# Altium project Carrier_Board_rev2.PrjPcb
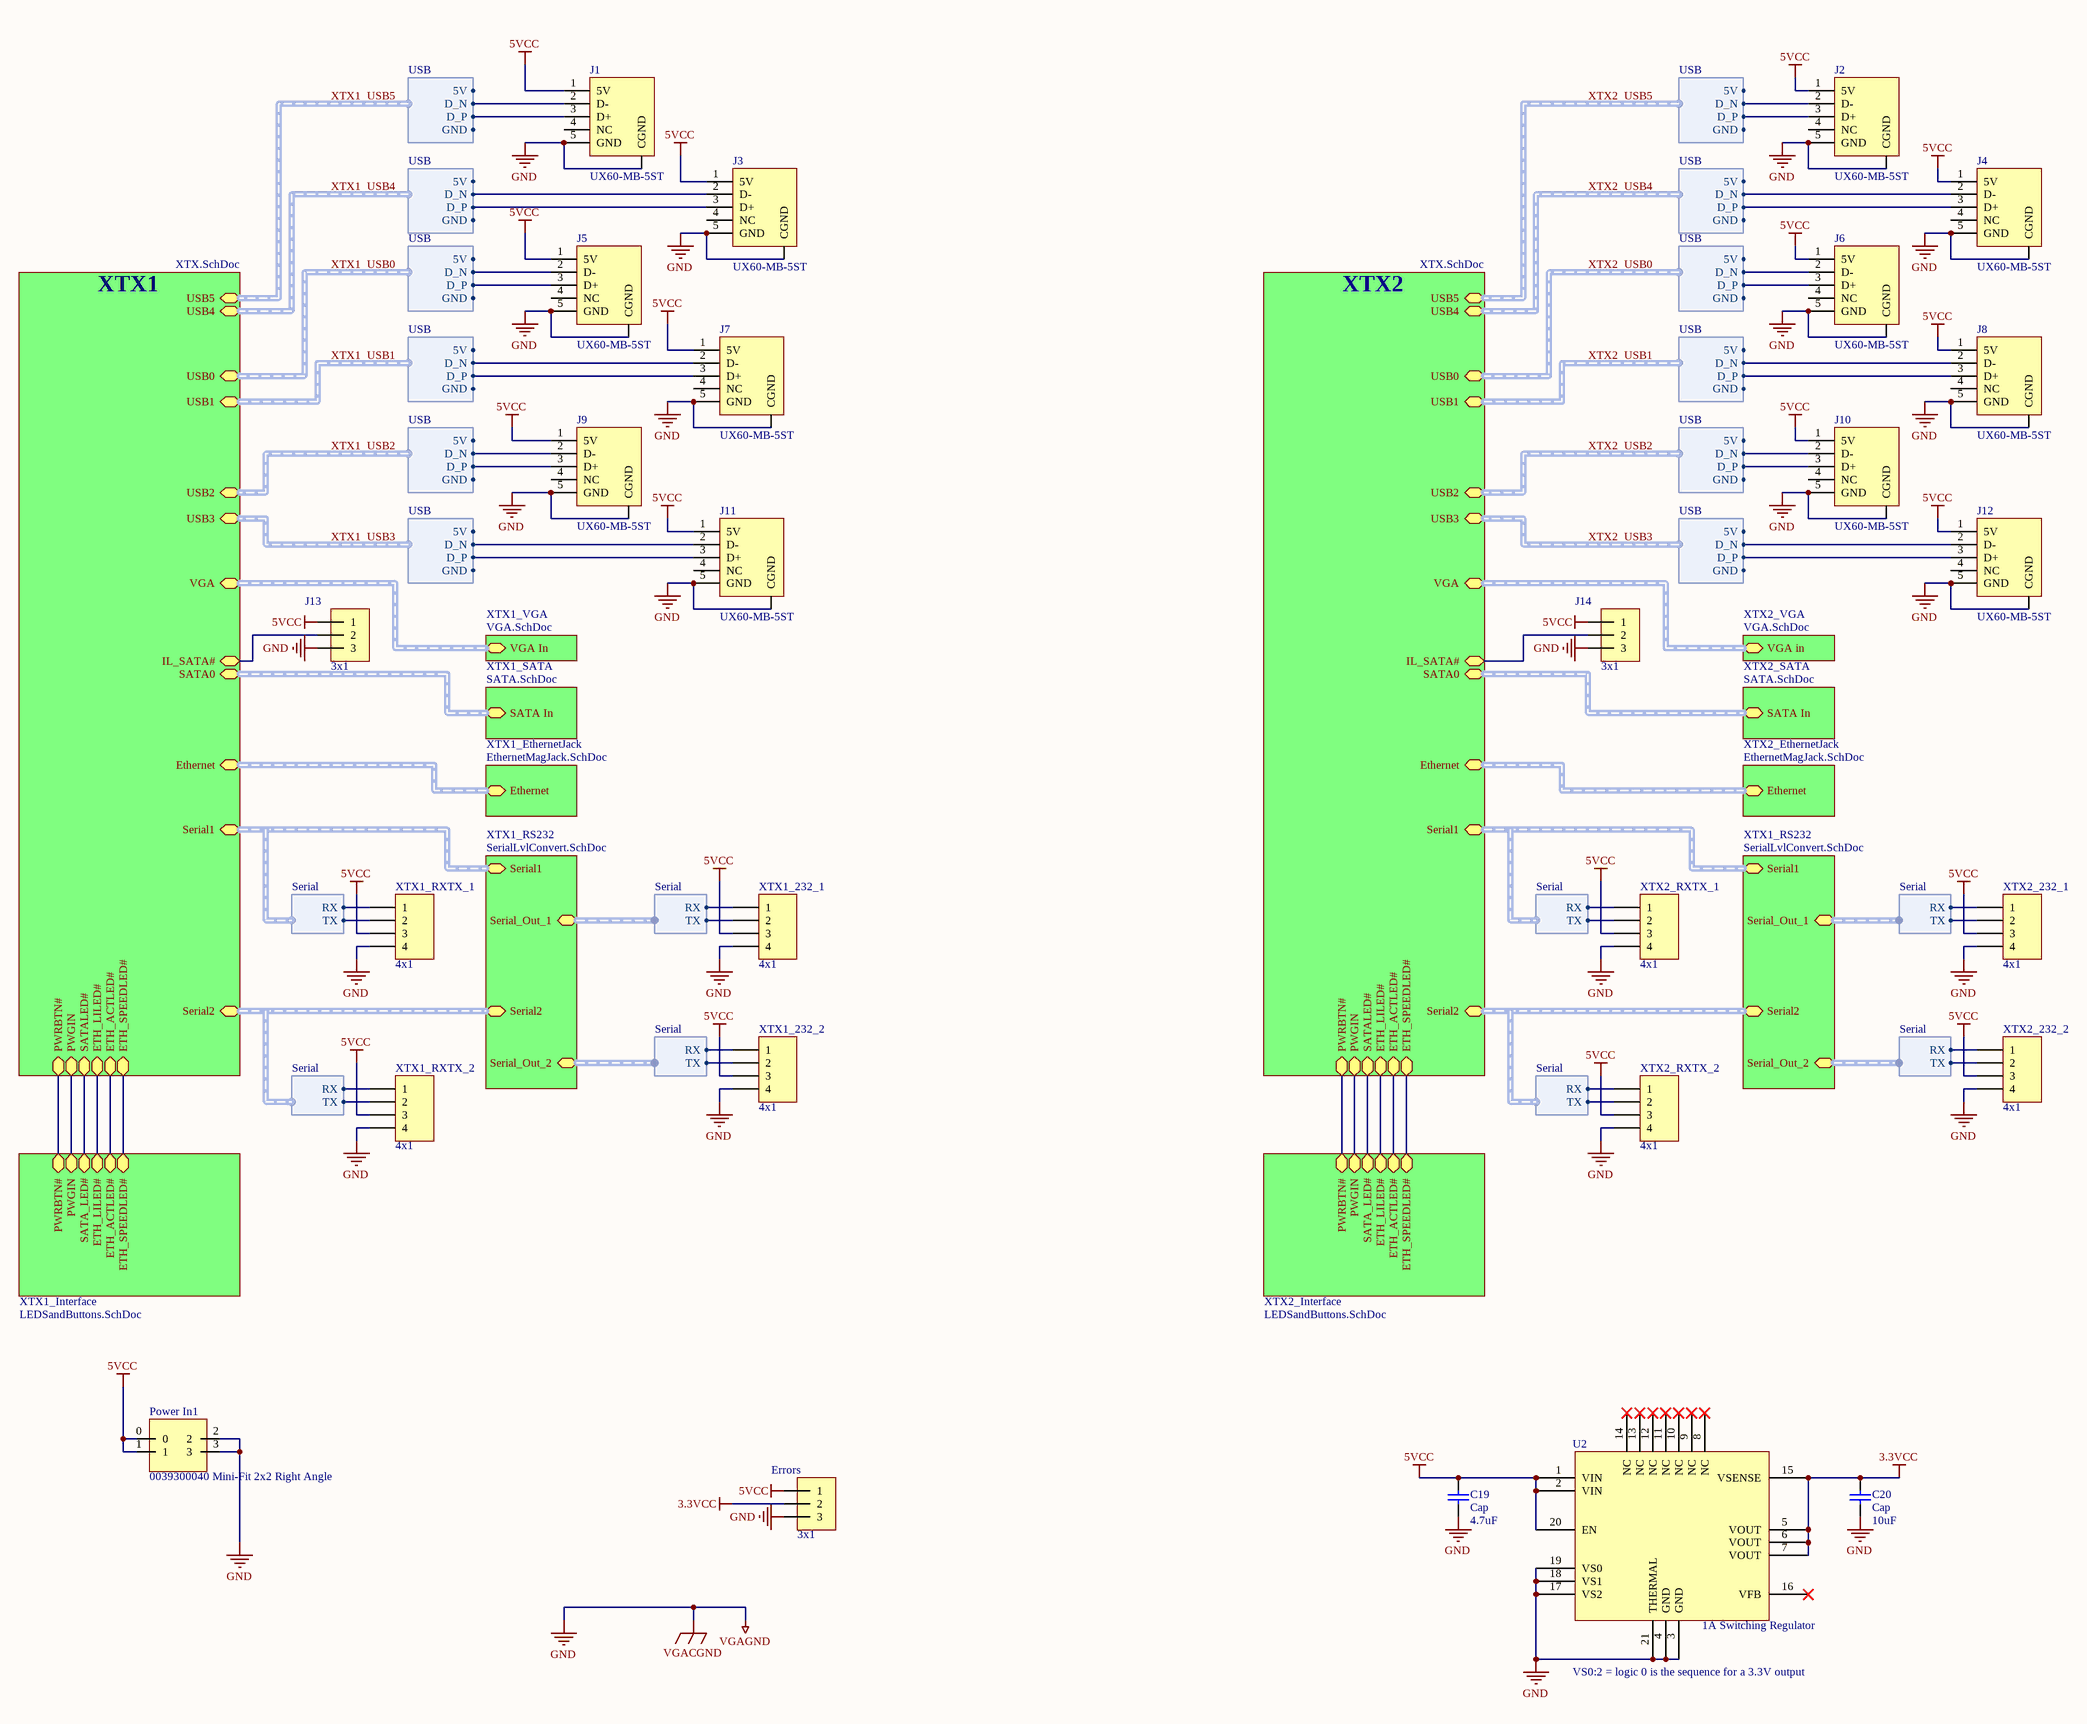
[diagram p0: XTXBoard(2CPU).SchDoc]
7 sheets, 137 parts. Net scope: hierarchical (ports join the sheet entries above them; power ports are global).
Board file: MainBoard.PcbDoc.PcbDoc
Sheets:
  XTXBoard(2CPU).SchDoc
    XTX1 = XTX.SchDoc
    XTX1_VGA = VGA.SchDoc
    XTX1_SATA = SATA.SchDoc
    XTX1_Interface = LEDSandButtons.SchDoc
    XTX1_EthernetJack = EthernetMagJack.SchDoc
    XTX2 = XTX.SchDoc
    XTX2_Interface = LEDSandButtons.SchDoc
    XTX2_VGA = VGA.SchDoc
    XTX2_SATA = SATA.SchDoc
    XTX2_EthernetJack = EthernetMagJack.SchDoc
    XTX1_RS232 = SerialLvlConvert.SchDoc
    XTX1_RS232 = SerialLvlConvert.SchDoc

## Sheet XTXBoard(2CPU).SchDoc
size C; DocumentNumber: 6; SheetNumber: 6; SheetTotal: 8

### Parts
C19  Cap  value 4.7uF  [0805 (2012) Capacitor]
C20  Cap  value 10uF  [1210 (3225) Capacitor]
Errors  3x1  [Male 3x1]
J1  UX60-MB-5ST  [UX60-MB-5ST]
J2  UX60-MB-5ST  [UX60-MB-5ST]
J3  UX60-MB-5ST  [UX60-MB-5ST]
J4  UX60-MB-5ST  [UX60-MB-5ST]
J5  UX60-MB-5ST  [UX60-MB-5ST]
J6  UX60-MB-5ST  [UX60-MB-5ST]
J7  UX60-MB-5ST  [UX60-MB-5ST]
J8  UX60-MB-5ST  [UX60-MB-5ST]
J9  UX60-MB-5ST  [UX60-MB-5ST]
J10  UX60-MB-5ST  [UX60-MB-5ST]
J11  UX60-MB-5ST  [UX60-MB-5ST]
J12  UX60-MB-5ST  [UX60-MB-5ST]
J13  3x1  [Male 3x1]
J14  3x1  [Male 3x1]
Power_In1  0039300040 Mini-Fit 2x2 Right Angle  [0039300040 MINI-FIT JR 4-Pos Right Angle]
U2  1A Switching Regulator  [QFN65P400X500X80-20N]
XTX1_232_1  4x1  [Male 4x1]
XTX1_232_2  4x1  [Male 4x1]
XTX1_RXTX_1  4x1  [Male 4x1]
XTX1_RXTX_2  4x1  [Male 4x1]
XTX2_232_1  4x1  [Male 4x1]
XTX2_232_2  4x1  [Male 4x1]
XTX2_RXTX_1  4x1  [Male 4x1]
XTX2_RXTX_2  4x1  [Male 4x1]

### Sub-sheets
XTX1 = XTX.SchDoc: ETH_LILED#, ETH_ACTLED#, ETH_SPEEDLED#, Ethernet (harness Ethernet), SATA0 (harness SATA), VGA (harness VGA), USB0 (harness USB), USB2 (harness USB), USB3 (harness USB), USB1 (harness USB), SATALED#, Serial1 (harness Serial), Serial2 (harness Serial), PWRBTN#, PWGIN, IL_SATA#, USB5 (harness USB), USB4 (harness USB)
XTX1_EthernetJack = EthernetMagJack.SchDoc: Ethernet (harness Ethernet)
XTX1_Interface = LEDSandButtons.SchDoc: ETH_LILED#, ETH_ACTLED#, SATA_LED#, PWRBTN#, ETH_SPEEDLED#, PWGIN
XTX1_RS232 = SerialLvlConvert.SchDoc: Serial1 (harness Serial), Serial2 (harness Serial), Serial_Out_1 (harness Serial), Serial_Out_2 (harness Serial)
XTX1_RS232 = SerialLvlConvert.SchDoc: Serial1 (harness Serial), Serial2 (harness Serial), Serial_Out_1 (harness Serial), Serial_Out_2 (harness Serial)
XTX1_SATA = SATA.SchDoc: SATA In (harness SATA)
XTX1_VGA = VGA.SchDoc: VGA In (harness VGA)
XTX2 = XTX.SchDoc: USB5 (harness USB), USB4 (harness USB), USB0 (harness USB), USB1 (harness USB), USB2 (harness USB), USB3 (harness USB), VGA (harness VGA), IL_SATA#, SATA0 (harness SATA), Ethernet (harness Ethernet), Serial1 (harness Serial), Serial2 (harness Serial), PWRBTN#, PWGIN, ETH_LILED#, SATALED#, ETH_ACTLED#, ETH_SPEEDLED#
XTX2_EthernetJack = EthernetMagJack.SchDoc: Ethernet (harness Ethernet)
XTX2_Interface = LEDSandButtons.SchDoc: PWRBTN#, PWGIN, SATA_LED#, ETH_LILED#, ETH_ACTLED#, ETH_SPEEDLED#
XTX2_SATA = SATA.SchDoc: SATA In (harness SATA)
XTX2_VGA = VGA.SchDoc: VGA in (harness VGA)

### Harnesses
USB: 5V, D_N, D_P, GND
Serial: RX, TX

### Nets
3.3VCC: C20.2 Errors.2 U2.5(VOUT) U2.6(VOUT) U2.7(VOUT) U2.15(VSENSE)
5VCC: C19.2 Errors.1 J1.1(5V) J2.1(5V) J3.1(5V) J4.1(5V) J5.1(5V) J6.1(5V) J7.1(5V) J8.1(5V) J9.1(5V) J10.1(5V) J11.1(5V) J12.1(5V) J13.1 J14.1 Power_In1.0 Power_In1.1 U2.1(VIN) U2.2(VIN) U2.20(EN) XTX1_232_1.3 XTX1_232_2.3 XTX1_RXTX_1.3 XTX1_RXTX_2.3 XTX2_232_1.3 XTX2_232_2.3 XTX2_RXTX_1.3 XTX2_RXTX_2.3
GND: C19.1 C20.1 Errors.3 J1.5(GND) J1.CGND J2.5(GND) J2.CGND J3.5(GND) J3.CGND J4.5(GND) J4.CGND J5.5(GND) J5.CGND J6.5(GND) J6.CGND J7.5(GND) J7.CGND J8.5(GND) J8.CGND J9.5(GND) J9.CGND J10.5(GND) J10.CGND J11.5(GND) J11.CGND J12.5(GND) J12.CGND J13.3 J14.3 Power_In1.2 Power_In1.3 U2.3(GND) U2.4(GND) U2.17(VS2) U2.18(VS1) U2.19(VS0) U2.21(THERMAL) XTX1_232_1.4 XTX1_232_2.4 XTX1_RXTX_1.4 XTX1_RXTX_2.4 XTX2_232_1.4 XTX2_232_2.4 XTX2_RXTX_1.4 XTX2_RXTX_2.4  [also labelled VGACGND, VGAGND]
ETH_ACTLED#: sheet XTX1/ETH_ACTLED#, sheet XTX1_Interface/ETH_ACTLED#
ETH_ACTLED#: sheet XTX2/ETH_ACTLED#, sheet XTX2_Interface/ETH_ACTLED#  [a separate net that carries the same name]
ETH_LILED#: sheet XTX1/ETH_LILED#, sheet XTX1_Interface/ETH_LILED#
ETH_LILED#: sheet XTX2/ETH_LILED#, sheet XTX2_Interface/ETH_LILED#  [a separate net that carries the same name]
ETH_SPEEDLED#: sheet XTX1/ETH_SPEEDLED#, sheet XTX1_Interface/ETH_SPEEDLED#
ETH_SPEEDLED#: sheet XTX2/ETH_SPEEDLED#, sheet XTX2_Interface/ETH_SPEEDLED#  [a separate net that carries the same name]
IL_SATA#: J13.2 ; sheet XTX1/IL_SATA#
IL_SATA#: J14.2 ; sheet XTX2/IL_SATA#  [a separate net that carries the same name]
IN_RX1: XTX1_RXTX_1.1 ; sheet XTX1/Serial1.RX
IN_RX1: XTX2_RXTX_1.1 ; sheet XTX2/Serial1.RX  [a separate net that carries the same name]
IN_RX2: XTX1_RXTX_2.1 ; sheet XTX1/Serial2.RX
IN_RX2: XTX2_RXTX_2.1 ; sheet XTX2/Serial2.RX  [a separate net that carries the same name]
IN_TX1: XTX1_RXTX_1.2 ; sheet XTX1/Serial1.TX
IN_TX1: XTX2_RXTX_1.2 ; sheet XTX2/Serial1.TX  [a separate net that carries the same name]
IN_TX2: XTX1_RXTX_2.2 ; sheet XTX1/Serial2.TX
IN_TX2: XTX2_RXTX_2.2 ; sheet XTX2/Serial2.TX  [a separate net that carries the same name]
OUT_RX1: XTX1_232_1.1 ; sheet XTX1_RS232/Serial_Out_1.RX
OUT_RX1: XTX2_232_1.1 ; sheet XTX1_RS232/Serial_Out_1.RX  [a separate net that carries the same name]
OUT_RX2: XTX1_232_2.1 ; sheet XTX1_RS232/Serial_Out_2.RX
OUT_RX2: XTX2_232_2.1 ; sheet XTX1_RS232/Serial_Out_2.RX  [a separate net that carries the same name]
OUT_TX1: XTX1_232_1.2 ; sheet XTX1_RS232/Serial_Out_1.TX
OUT_TX1: XTX2_232_1.2 ; sheet XTX1_RS232/Serial_Out_1.TX  [a separate net that carries the same name]
OUT_TX2: XTX1_232_2.2 ; sheet XTX1_RS232/Serial_Out_2.TX
OUT_TX2: XTX2_232_2.2 ; sheet XTX1_RS232/Serial_Out_2.TX  [a separate net that carries the same name]
SATALED#: sheet XTX1/SATALED#, sheet XTX1_Interface/SATA_LED#
SATALED#: sheet XTX2/SATALED#, sheet XTX2_Interface/SATA_LED#  [a separate net that carries the same name]
USB0_N: J5.2(D-) ; sheet XTX1/USB0.D_N
USB0_N: J6.2(D-) ; sheet XTX2/USB0.D_N  [a separate net that carries the same name]
USB0_P: J5.3(D+) ; sheet XTX1/USB0.D_P
USB0_P: J6.3(D+) ; sheet XTX2/USB0.D_P  [a separate net that carries the same name]
USB1_N: J7.2(D-) ; sheet XTX1/USB1.D_N
USB1_N: J8.2(D-) ; sheet XTX2/USB1.D_N  [a separate net that carries the same name]
USB1_P: J7.3(D+) ; sheet XTX1/USB1.D_P
USB1_P: J8.3(D+) ; sheet XTX2/USB1.D_P  [a separate net that carries the same name]
USB2_N: J9.2(D-) ; sheet XTX1/USB2.D_N
USB2_N: J10.2(D-) ; sheet XTX2/USB2.D_N  [a separate net that carries the same name]
USB2_P: J9.3(D+) ; sheet XTX1/USB2.D_P
USB2_P: J10.3(D+) ; sheet XTX2/USB2.D_P  [a separate net that carries the same name]
USB3_N: J11.2(D-) ; sheet XTX1/USB3.D_N
USB3_N: J12.2(D-) ; sheet XTX2/USB3.D_N  [a separate net that carries the same name]
USB3_P: J11.3(D+) ; sheet XTX1/USB3.D_P
USB3_P: J12.3(D+) ; sheet XTX2/USB3.D_P  [a separate net that carries the same name]
USB4_N: J3.2(D-) ; sheet XTX1/USB4.D_N
USB4_N: J4.2(D-) ; sheet XTX2/USB4.D_N  [a separate net that carries the same name]
USB4_P: J3.3(D+) ; sheet XTX1/USB4.D_P
USB4_P: J4.3(D+) ; sheet XTX2/USB4.D_P  [a separate net that carries the same name]
USB5_N: J1.2(D-) ; sheet XTX1/USB5.D_N
USB5_N: J2.2(D-) ; sheet XTX2/USB5.D_N  [a separate net that carries the same name]
USB5_P: J1.3(D+) ; sheet XTX1/USB5.D_P
USB5_P: J2.3(D+) ; sheet XTX2/USB5.D_P  [a separate net that carries the same name]
NetXTX1_Interface_D5_2: sheet XTX1/PWRBTN#, sheet XTX1_Interface/PWRBTN#
NetXTX1_Interface_PWGIN_Switch_1: sheet XTX1/PWGIN, sheet XTX1_Interface/PWGIN
NetXTX2_Interface_D5_2: sheet XTX2/PWRBTN#, sheet XTX2_Interface/PWRBTN#
NetXTX2_Interface_PWGIN_Switch_1: sheet XTX2/PWGIN, sheet XTX2_Interface/PWGIN

Not connected (* = marked no-connect by the designer): J1 4(NC); J2 4(NC); J3 4(NC); J4 4(NC); J5 4(NC); J6 4(NC); J7 4(NC); J8 4(NC); J9 4(NC); J10 4(NC); J11 4(NC); J12 4(NC); U2 8(NC)* 9(NC)* 10(NC)* 11(NC)* 12(NC)* 13(NC)* 14(NC)* 16(VFB)*

### Buses and harness runs
harness sheet XTX1/Ethernet = sheet XTX1_EthernetJack/Ethernet
harness sheet XTX1/SATA0 = sheet XTX1_SATA/SATA In
harness sheet XTX1/Serial1 = sheet XTX1_RS232/Serial1
harness sheet XTX1/Serial2 = sheet XTX1_RS232/Serial2
harness sheet XTX1/VGA = sheet XTX1_VGA/VGA In
harness sheet XTX1_RS232/Serial1 = sheet XTX2/Serial1
harness sheet XTX1_RS232/Serial2 = sheet XTX2/Serial2
harness sheet XTX2/Ethernet = sheet XTX2_EthernetJack/Ethernet
harness sheet XTX2/SATA0 = sheet XTX2_SATA/SATA In
harness sheet XTX2/VGA = sheet XTX2_VGA/VGA in
harness XTX1_USB0 = sheet XTX1/USB0
harness XTX1_USB1 = sheet XTX1/USB1
harness XTX1_USB2 = sheet XTX1/USB2
harness XTX1_USB3 = sheet XTX1/USB3
harness XTX1_USB4 = sheet XTX1/USB4
harness XTX1_USB5 = sheet XTX1/USB5
harness XTX2_USB0 = sheet XTX2/USB0
harness XTX2_USB1 = sheet XTX2/USB1
harness XTX2_USB2 = sheet XTX2/USB2
harness XTX2_USB3 = sheet XTX2/USB3
harness XTX2_USB4 = sheet XTX2/USB4
harness XTX2_USB5 = sheet XTX2/USB5

### Notes on the sheet
- (near U2) VS0:2 = logic 0 is the sequence for a 3.3V output

### Library data of the parts
C19 C20 = Cap: Capacitor; Published: 8-Jun-2000; LatestRevisionDate: 17-Jul-2002; LatestRevisionNote: Re-released for DXP Platform.; PackageReference: RAD-0.3; Publisher: Altium Limited; Supplier: Digi-Key
  C19: Supplier Part Number: 490-3901-1-ND
  C20: Supplier Part Number: 445-1401-1-ND
Errors J13 J14 = 3x1: 3x1 100mil Header; Supplier Part Number: 929400E-01-36-ND; Supplier: Digi-Key
J1-J12 = UX60-MB-5ST: miniUSB Type B SMT Connector; Supplier Part Number: H2959CT-ND; Supplier: Digi-Key
U2 = Component_1: 1A Step Down Voltage Converter; Manufacturer 1: Enpirion; Manufacturer 1 Part Number: EN5311QI; Supplier: Mouser; Supplier Part Number: 884-EN5311QI
XTX1_232_1 XTX1_232_2 XTX1_RXTX_1 XTX1_RXTX_2 XTX2_232_1 XTX2_232_2 XTX2_RXTX_1 XTX2_RXTX_2 = Header 4: Header, 4-Pin; LatestRevisionDate: 17-Jul-2002; LatestRevisionNote: Re-released for DXP Platform.; Publisher: Altium Limited; Supplier Part Number: 929400E-01-36-ND; Supplier: Digi-Key
Power_In1 = 0039300040 Mini-Fit 2x2 Right Angle: Supplier Part Number: WM21352-ND; Supplier: Digi-Key

## Sheet XTX.SchDoc
size C; DocumentNumber: 3; SheetNumber: 3; SheetTotal: 8
Used 2 times, as channels XTX1, XTX2. Parts and nets are listed once, with the designators drawn on the sheet.
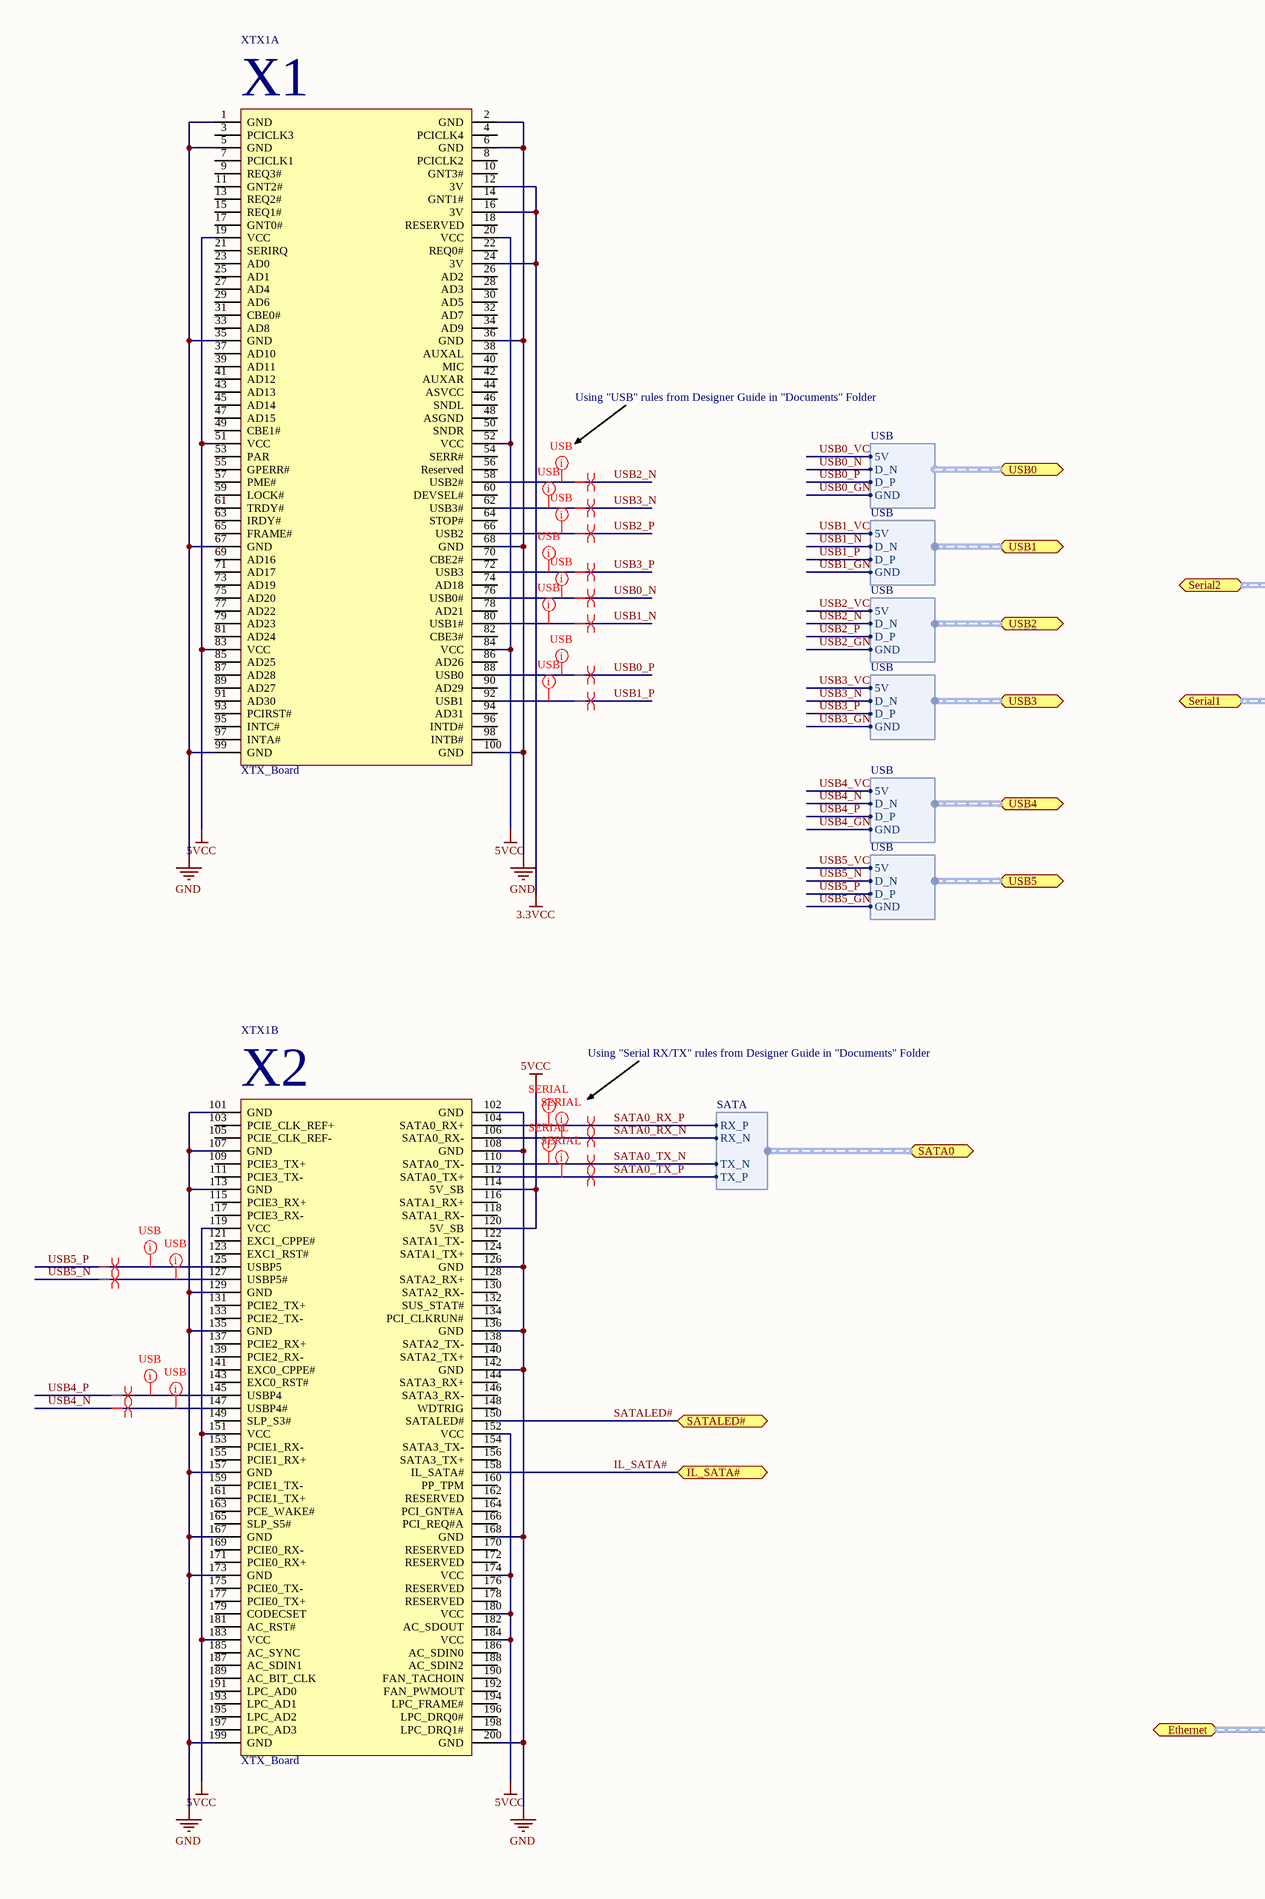
[diagram p1: XTX.SchDoc, left]
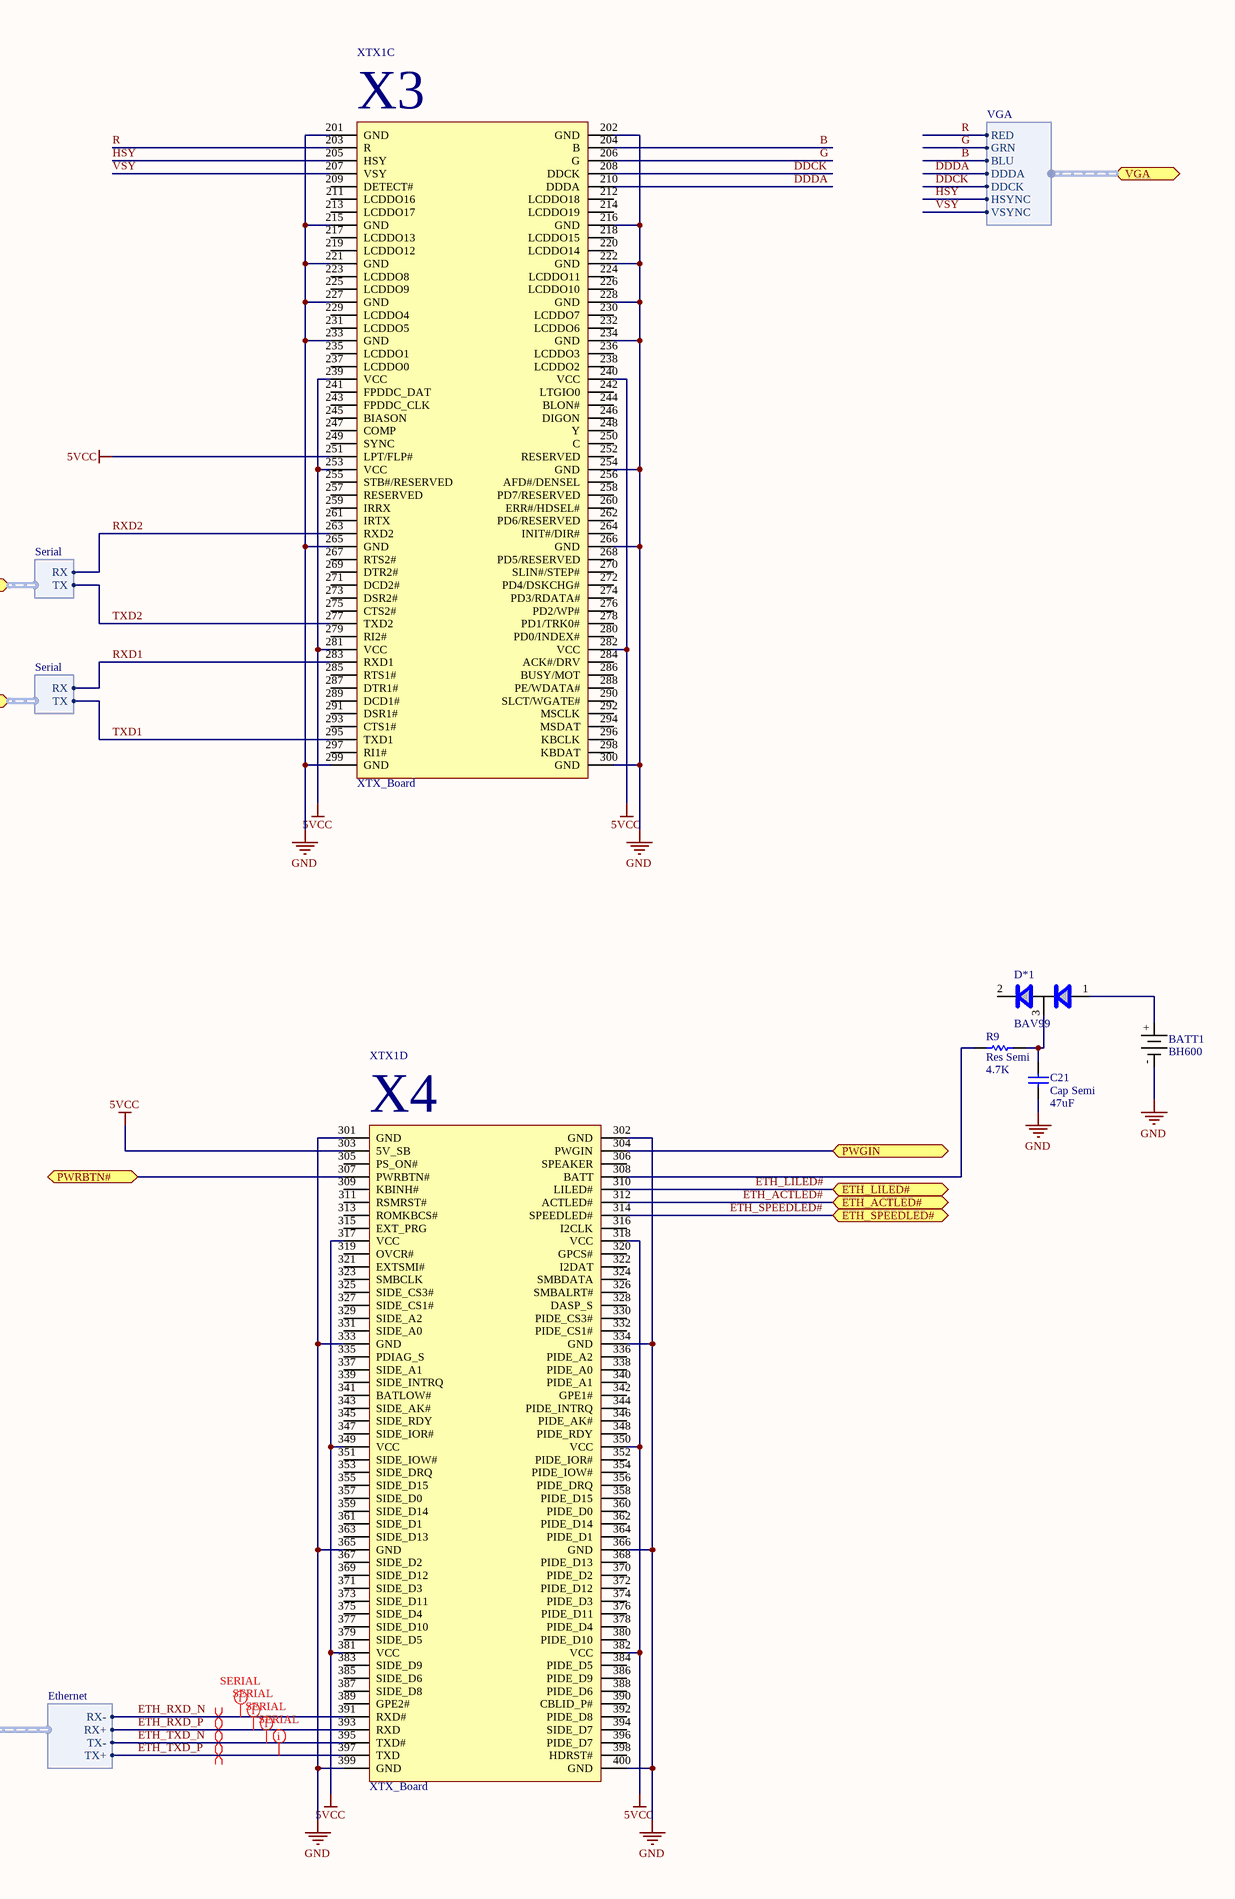
[diagram p2: XTX.SchDoc, right]

### Parts
BATT1  BH600  [BH600]
C21  Cap Semi  value 47uF  [1210 (3225) Capacitor]
D*1  BAV99  [SOT-23]
R9  Res Semi  value 4.7K  [1005[0402]]
XTX1  XTX_Board  [XTX_Board]  (parts A,B,C,D of 4)

### Ports
ETH_ACTLED#, ETH_LILED#, ETH_SPEEDLED#, Ethernet (harness Ethernet), IL_SATA#, PWGIN, PWRBTN#, SATA0 (harness SATA), SATALED#, Serial1 (harness Serial), Serial2 (harness Serial), USB0 (harness USB), USB1 (harness USB), USB2 (harness USB), USB3 (harness USB), USB4 (harness USB), USB5 (harness USB), VGA (harness VGA)

### Harnesses
Ethernet: RX-, RX+, TX-, TX+
USB: 5V, D_N, D_P, GND
Serial: RX, TX
VGA: RED, GRN, BLU, HSYNC, VSYNC, DDCK, DDDA
SATA: TX_P, TX_N, RX_N, RX_P

### Nets
3.3VCC: XTX1.12(3V) XTX1.16(3V) XTX1.24(3V)
5VCC: XTX1.19(VCC) XTX1.20(VCC) XTX1.51(VCC) XTX1.52(VCC) XTX1.83(VCC) XTX1.84(VCC) XTX1.114(5V_SB) XTX1.119(VCC) XTX1.120(5V_SB) XTX1.151(VCC) XTX1.152(VCC) XTX1.174(VCC) XTX1.180(VCC) XTX1.183(VCC) XTX1.184(VCC) XTX1.239(VCC) XTX1.240(VCC) XTX1.251(LPT/FLP#) XTX1.253(VCC) XTX1.281(VCC) XTX1.282(VCC) XTX1.303(5V_SB) XTX1.317(VCC) XTX1.318(VCC) XTX1.349(VCC) XTX1.350(VCC) XTX1.381(VCC) XTX1.382(VCC)
GND: BATT1.- C21.1 XTX1.1(GND) XTX1.2(GND) XTX1.5(GND) XTX1.6(GND) XTX1.35(GND) XTX1.36(GND) XTX1.67(GND) XTX1.68(GND) XTX1.99(GND) XTX1.100(GND) XTX1.101(GND) XTX1.102(GND) XTX1.107(GND) XTX1.108(GND) XTX1.113(GND) XTX1.126(GND) XTX1.129(GND) XTX1.135(GND) XTX1.136(GND) XTX1.142(GND) XTX1.157(GND) XTX1.167(GND) XTX1.168(GND) XTX1.173(GND) XTX1.199(GND) XTX1.200(GND) XTX1.201(GND) XTX1.202(GND) XTX1.215(GND) XTX1.216(GND) XTX1.221(GND) XTX1.222(GND) XTX1.227(GND) XTX1.228(GND) XTX1.233(GND) XTX1.234(GND) XTX1.254(GND) XTX1.265(GND) XTX1.266(GND) XTX1.299(GND) XTX1.300(GND) XTX1.301(GND) XTX1.302(GND) XTX1.333(GND) XTX1.334(GND) XTX1.365(GND) XTX1.366(GND) XTX1.399(GND) XTX1.400(GND)
B: XTX1.204(B) ; port VGA.BLU
DDCK: XTX1.208(DDCK) ; port VGA.DDCK
DDDA: XTX1.210(DDDA) ; port VGA.DDDA
ETH_ACTLED#: XTX1.312(ACTLED#) ; port ETH_ACTLED#
ETH_LILED#: XTX1.310(LILED#) ; port ETH_LILED#
ETH_RXD_N: XTX1.391(RXD#) ; port Ethernet.RX-
ETH_RXD_P: XTX1.393(RXD) ; port Ethernet.RX+
ETH_SPEEDLED#: XTX1.314(SPEEDLED#) ; port ETH_SPEEDLED#
ETH_TXD_N: XTX1.395(TXD#) ; port Ethernet.TX-
ETH_TXD_P: XTX1.397(TXD) ; port Ethernet.TX+
G: XTX1.206(G) ; port VGA.GRN
HSY: XTX1.205(HSY) ; port VGA.HSYNC
IL_SATA#: XTX1.158(IL_SATA#) ; port IL_SATA#
PWGIN: XTX1.304(PWGIN) ; port PWGIN
PWRBTN#: XTX1.307(PWRBTN#) ; port PWRBTN#
R: XTX1.203(R) ; port VGA.RED
RXD1: XTX1.283(RXD1) ; port Serial1.RX
RXD2: XTX1.263(RXD2) ; port Serial2.RX
SATA0_RX_N: XTX1.106(SATA0_RX-) ; port SATA0.RX_N
SATA0_RX_P: XTX1.104(SATA0_RX+) ; port SATA0.RX_P
SATA0_TX_N: XTX1.110(SATA0_TX-) ; port SATA0.TX_N
SATA0_TX_P: XTX1.112(SATA0_TX+) ; port SATA0.TX_P
SATALED#: XTX1.150(SATALED#) ; port SATALED#
TXD1: XTX1.295(TXD1) ; port Serial1.TX
TXD2: XTX1.277(TXD2) ; port Serial2.TX
USB0_GND: port USB0.GND
USB0_N: XTX1.76(USB0#) ; port USB0.D_N
USB0_P: XTX1.88(USB0) ; port USB0.D_P
USB0_VCC: port USB0.5V
USB1_GND: port USB1.GND
USB1_N: XTX1.80(USB1#) ; port USB1.D_N
USB1_P: XTX1.92(USB1) ; port USB1.D_P
USB1_VCC: port USB1.5V
USB2_GND: port USB2.GND
USB2_N: XTX1.58(USB2#) ; port USB2.D_N
USB2_P: XTX1.66(USB2) ; port USB2.D_P
USB2_VCC: port USB2.5V
USB3_GND: port USB3.GND
USB3_N: XTX1.62(USB3#) ; port USB3.D_N
USB3_P: XTX1.72(USB3) ; port USB3.D_P
USB3_VCC: port USB3.5V
USB4_GND: port USB4.GND
USB4_N: XTX1.147(USBP4#) ; port USB4.D_N
USB4_P: XTX1.145(USBP4) ; port USB4.D_P
USB4_VCC: port USB4.5V
USB5_GND: port USB5.GND
USB5_N: XTX1.127(USBP5#) ; port USB5.D_N
USB5_P: XTX1.125(USBP5) ; port USB5.D_P
USB5_VCC: port USB5.5V
VSY: XTX1.207(VSY) ; port VGA.VSYNC
NetBATT1_+: BATT1.+ D*1.1
NetC21_2: C21.2 D*1.3 R9.2
NetR9_1: R9.1 XTX1.308(BATT)

Not connected (* = marked no-connect by the designer): D*1 2; XTX1 3(PCICLK3) 4(PCICLK4) 7(PCICLK1) 8(PCICLK2) 9(REQ3#) 10(GNT3#) 11(GNT2#) 13(REQ2#) 14(GNT1#) 15(REQ1#) 17(GNT0#) 18(RESERVED) 21(SERIRQ) 22(REQ0#) 23(AD0) 25(AD1) 26(AD2) 27(AD4) 28(AD3) 29(AD6) 30(AD5) 31(CBE0#) 32(AD7) 33(AD8) 34(AD9) 37(AD10) 38(AUXAL) 39(AD11) 40(MIC) 41(AD12) 42(AUXAR) 43(AD13) 44(ASVCC) 45(AD14) 46(SNDL) 47(AD15) 48(ASGND) 49(CBE1#) 50(SNDR) 53(PAR) 54(SERR#) 55(GPERR#) 56(Reserved) 57(PME#) 59(LOCK#) 60(DEVSEL#) 61(TRDY#) 63(IRDY#) 64(STOP#) 65(FRAME#) 69(AD16) 70(CBE2#) 71(AD17) 73(AD19) 74(AD18) 75(AD20) 77(AD22) 78(AD21) 79(AD23) 81(AD24) 82(CBE3#) 85(AD25) 86(AD26) 87(AD28) 89(AD27) 90(AD29) 91(AD30) 93(PCIRST#) 94(AD31) 95(INTC#) 96(INTD#) 97(INTA#) 98(INTB#) 103(PCIE_CLK_REF+) 105(PCIE_CLK_REF-) 109(PCIE3_TX+) 111(PCIE3_TX-) 115(PCIE3_RX+) 116(SATA1_RX+) 117(PCIE3_RX-) 118(SATA1_RX-) 121(EXC1_CPPE#) 122(SATA1_TX-) 123(EXC1_RST#) 124(SATA1_TX+) 128(SATA2_RX+) 130(SATA2_RX-) 131(PCIE2_TX+) 132(SUS_STAT#) 133(PCIE2_TX-) 134(PCI_CLKRUN#) 137(PCIE2_RX+) 138(SATA2_TX-) 139(PCIE2_RX-) 140(SATA2_TX+) 141(EXC0_CPPE#) 143(EXC0_RST#) 144(SATA3_RX+) 146(SATA3_RX-) 148(WDTRIG) 149(SLP_S3#) 153(PCIE1_RX-) 154(SATA3_TX-) 155(PCIE1_RX+) 156(SATA3_TX+) 159(PCIE1_TX-) 160(PP_TPM) 161(PCIE1_TX+) 162(RESERVED) 163(PCE_WAKE#) 164(PCI_GNT#A) 165(SLP_S5#) 166(PCI_REQ#A) 169(PCIE0_RX-) 170(RESERVED) 171(PCIE0_RX+) 172(RESERVED) 175(PCIE0_TX-) 176(RESERVED) 177(PCIE0_TX+) 178(RESERVED) 179(CODECSET) 181(AC_RST#) 182(AC_SDOUT) 185(AC_SYNC) 186(AC_SDIN0) 187(AC_SDIN1) 188(AC_SDIN2) 189(AC_BIT_CLK) 190(FAN_TACHOIN) 191(LPC_AD0) 192(FAN_PWMOUT) 193(LPC_AD1) 194(LPC_FRAME#) 195(LPC_AD2) 196(LPC_DRQ0#) 197(LPC_AD3) 198(LPC_DRQ1#) 209(DETECT#) 211(LCDDO16) 212(LCDDO18) 213(LCDDO17) 214(LCDDO19) 217(LCDDO13) 218(LCDDO15) 219(LCDDO12) 220(LCDDO14) 223(LCDDO8) 224(LCDDO11) 225(LCDDO9) 226(LCDDO10) 229(LCDDO4) 230(LCDDO7) 231(LCDDO5) 232(LCDDO6) 235(LCDDO1) 236(LCDDO3) 237(LCDDO0) 238(LCDDO2) 241(FPDDC_DAT) 242(LTGIO0) 243(FPDDC_CLK) 244(BLON#) 245(BIASON) 246(DIGON) 247(COMP) 248(Y) 249(SYNC) 250(C) 252(RESERVED) 255(STB#/RESERVED) 256(AFD#/DENSEL) 257(RESERVED) 258(PD7/RESERVED) 259(IRRX) 260(ERR#/HDSEL#) 261(IRTX) 262(PD6/RESERVED) 264(INIT#/DIR#) 267(RTS2#) 268(PD5/RESERVED) 269(DTR2#) 270(SLIN#/STEP#) 271(DCD2#) 272(PD4/DSKCHG#) 273(DSR2#) 274(PD3/RDATA#) 275(CTS2#) 276(PD2/WP#) 278(PD1/TRK0#) 279(RI2#) 280(PD0/INDEX#) 284(ACK#/DRV) 285(RTS1#) 286(BUSY/MOT) 287(DTR1#) 288(PE/WDATA#) 289(DCD1#) 290(SLCT/WGATE#) 291(DSR1#) 292(MSCLK) 293(CTS1#) 294(MSDAT) 296(KBCLK) 297(RI1#) 298(KBDAT) 305(PS_ON#) 306(SPEAKER) 309(KBINH#) 311(RSMRST#) 313(ROMKBCS#) 315(EXT_PRG) 316(I2CLK) 319(OVCR#) 320(GPCS#) 321(EXTSMI#) 322(I2DAT) 323(SMBCLK) 324(SMBDATA) 325(SIDE_CS3#) 326(SMBALRT#) 327(SIDE_CS1#) 328(DASP_S) 329(SIDE_A2) 330(PIDE_CS3#) 331(SIDE_A0) 332(PIDE_CS1#) 335(PDIAG_S) 336(PIDE_A2) 337(SIDE_A1) 338(PIDE_A0) 339(SIDE_INTRQ) 340(PIDE_A1) 341(BATLOW#) 342(GPE1#) 343(SIDE_AK#) 344(PIDE_INTRQ) 345(SIDE_RDY) 346(PIDE_AK#) 347(SIDE_IOR#) 348(PIDE_RDY) 351(SIDE_IOW#) 352(PIDE_IOR#) 353(SIDE_DRQ) 354(PIDE_IOW#) 355(SIDE_D15) 356(PIDE_DRQ) 357(SIDE_D0) 358(PIDE_D15) 359(SIDE_D14) 360(PIDE_D0) 361(SIDE_D1) 362(PIDE_D14) 363(SIDE_D13) 364(PIDE_D1) 367(SIDE_D2) 368(PIDE_D13) 369(SIDE_D12) 370(PIDE_D2) 371(SIDE_D3) 372(PIDE_D12) 373(SIDE_D11) 374(PIDE_D3) 375(SIDE_D4) 376(PIDE_D11) 377(SIDE_D10) 378(PIDE_D4) 379(SIDE_D5) 380(PIDE_D10) 383(SIDE_D9) 384(PIDE_D5) 385(SIDE_D6) 386(PIDE_D9) 387(SIDE_D8) 388(PIDE_D6) 389(GPE2#) 390(CBLID_P#) 392(PIDE_D8) 394(SIDE_D7) 396(PIDE_D7) 398(HDRST#)

### Channels
XTX1: designators BATT1=XTX1_BATT1 C21=XTX1_C21 D*1=XTX1_D*1 R9=XTX1_R9 XTX1=XTX1_XTX1; ports ETH_ACTLED#=ETH_ACTLED# ETH_LILED#=ETH_LILED# ETH_SPEEDLED#=ETH_SPEEDLED# IL_SATA#=IL_SATA# PWGIN=NetXTX1_Interface_PWGIN_Switch_1 PWRBTN#=NetXTX1_Interface_D5_2 SATALED#=SATALED#
XTX2: designators BATT1=XTX2_BATT1 C21=XTX2_C21 D*1=XTX2_D*1 R9=XTX2_R9 XTX1=XTX2_XTX1; ports ETH_ACTLED#=ETH_ACTLED# ETH_LILED#=ETH_LILED# ETH_SPEEDLED#=ETH_SPEEDLED# IL_SATA#=IL_SATA# PWGIN=NetXTX2_Interface_PWGIN_Switch_1 PWRBTN#=NetXTX2_Interface_D5_2 SATALED#=SATALED#

### Layout directives
differential pair: ETH_RXD_N, ETH_RXD_P, ETH_TXD_N, ETH_TXD_P, SATA0_RX_N, SATA0_RX_P, SATA0_TX_N, SATA0_TX_P, USB0_N, USB0_P, USB1_N, USB1_P, USB2_N, USB2_P, USB3_N, USB3_P, USB4_N, USB4_P, USB5_N, USB5_P
rule Width Constraint [Pref Width = 7mil    Min Width = 7mil    Max Width = 7mil]; rule Length Constraint [Min Length = 0mil    Max Length = 18000mil]; rule Differential Pairs Routing [Pref Gap = 5mil    Min Gap  = 5mil    Max Gap  = 5mil]; rule Matched Net Lengths [Tolerance = 200mil]; net class USB: USB0_N, USB0_P, USB1_N, USB1_P, USB2_N, USB2_P, USB3_N, USB3_P, USB4_N, USB4_P, USB5_N, USB5_P
rule Width Constraint [Pref Width = 5mil    Min Width = 5mil    Max Width = 5mil]; rule Length Constraint [Min Length = 0mil    Max Length = 6500mil]; rule Differential Pairs Routing [Pref Gap = 4mil    Min Gap  = 4mil    Max Gap  = 4mil]; rule Matched Net Lengths [Tolerance = 3000mil]; net class USB: ETH_RXD_N, ETH_RXD_P, ETH_TXD_N, ETH_TXD_P, SATA0_RX_N, SATA0_RX_P, SATA0_TX_N, SATA0_TX_P

### Notes on the sheet
- Using "USB" rules from Designer Guide in "Documents" Folder
- Using "Serial RX/TX" rules from Designer Guide in "Documents" Folder
- (in symbol XTX_Board, part A) X1
- (in symbol XTX_Board, part B) X2
- (in symbol XTX_Board, part C) X3
- (in symbol XTX_Board, part D) X4

### Library data of the parts
BATT1 = BH600: 16mm Battery Holder - Memory Protection Devices; Supplier Part Number: BH600-ND; Supplier: Digi-Key
C21 = Cap Semi: Capacitor (Semiconductor SIM Model); Published: 8-Jun-2000; LatestRevisionDate: 17-Jul-2002; LatestRevisionNote: Re-released for DXP Platform.; PackageReference: C1206; Publisher: Altium Limited; Supplier Part Number: 490-1887-1-ND; Supplier: Digi-Key
D*1 = BAV99: Dual Surface Mount Switching Diode; Supplier Part Number: BAV99-FDICT-ND; Supplier: Digi-Key
R9 = Res Semi: Semiconductor Resistor; Published: 8-Jun-2000; LatestRevisionDate: 17-Jul-2002; LatestRevisionNote: Re-released for DXP Platform.; PackageReference: AXIAL-0.5; Publisher: Altium Limited; Supplier Part Number: P4.7KJCT-ND; Supplier: Digi-Key
XTX1 = XTX_Board: Datasheet: http://www.xtx-standard.org/fileadmin/documents/XTX-Spec12.pdf

## Sheet VGA.SchDoc
size B; DocumentNumber: 5; SheetNumber: 5; SheetTotal: 8
Used 2 times, as channels XTX1_VGA, XTX2_VGA. Parts and nets are listed once, with the designators drawn on the sheet.
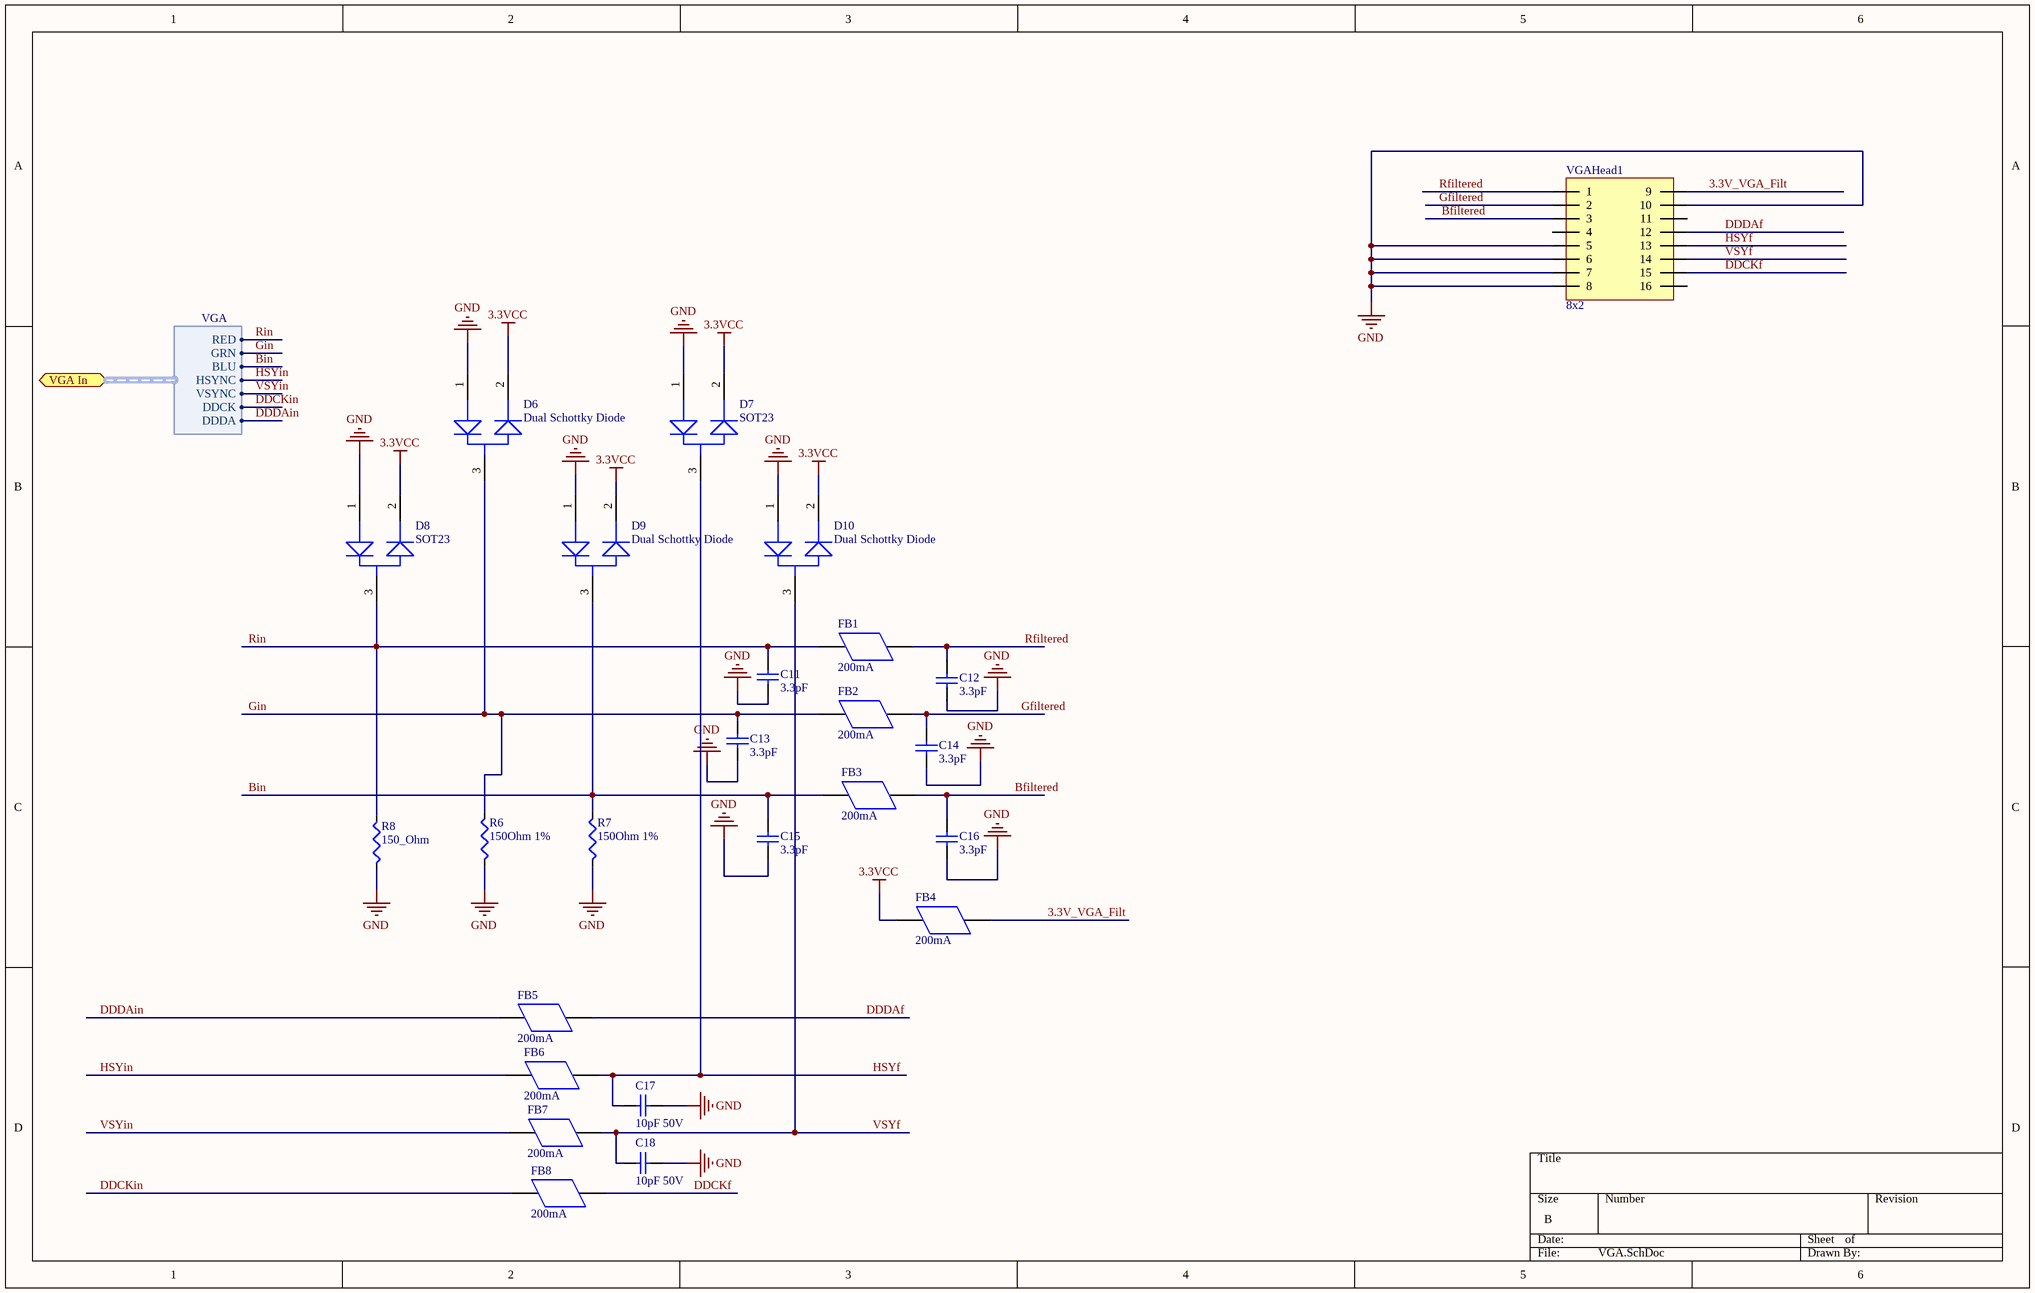
[diagram p3: VGA.SchDoc]

### Parts
C11  3.3pF  [0805 (2012) Capacitor]
C12  3.3pF  [0805 (2012) Capacitor]
C13  3.3pF  [0805 (2012) Capacitor]
C14  3.3pF  [0805 (2012) Capacitor]
C15  3.3pF  [0805 (2012) Capacitor]
C16  3.3pF  [0805 (2012) Capacitor]
C17  10pF 50V  [0805 (2012) Capacitor]
C18  10pF 50V  [0805 (2012) Capacitor]
D6  Dual Schottky Diode  [SOT23]
D7  SOT23  [SOT23]
D8  SOT23  [SOT23]
D9  Dual Schottky Diode  [SOT23]
D10  Dual Schottky Diode  [SOT23]
FB1  200mA  [0805 (2012) Capacitor]
FB2  200mA  [0805 (2012) Capacitor]
FB3  200mA  [0805 (2012) Capacitor]
FB4  200mA  [0805 (2012) Capacitor]
FB5  200mA  [0805 (2012) Capacitor]
FB6  200mA  [0805 (2012) Capacitor]
FB7  200mA  [0805 (2012) Capacitor]
FB8  200mA  [0805 (2012) Capacitor]
R6  150Ohm 1%  [R 0805 (2012) RESISTOR]
R7  150Ohm 1%  [R 0805 (2012) RESISTOR]
R8  150_Ohm  [R 0805 (2012) RESISTOR]
VGAHead1  8x2  [Male 8x2]

### Ports
VGA In (harness VGA)

### Harnesses
VGA: RED, GRN, BLU, HSYNC, VSYNC, DDCK, DDDA

### Nets
3.3VCC: D6.2 D7.2 D8.2 D9.2 D10.2 FB4.1
GND: C11.2 C12.2 C13.2 C14.2 C15.2 C16.2 C17.1 C18.1 D6.1 D7.1 D8.1 D9.1 D10.1 R6.1 R7.1 R8.1 VGAHead1.5 VGAHead1.6 VGAHead1.7 VGAHead1.8 VGAHead1.10
3.3V_VGA_Filt: FB4.2 VGAHead1.9
Bfiltered: C16.1 FB3.2 VGAHead1.3
Bin: C15.1 D9.3 FB3.1 R7.2 ; port VGA In.BLU
DDCKf: FB8.2 VGAHead1.15
DDCKin: FB8.1 ; port VGA In.DDCK
DDDAf: FB5.2 VGAHead1.12
DDDAin: FB5.1 ; port VGA In.DDDA
Gfiltered: C14.1 FB2.2 VGAHead1.2
Gin: C13.1 D6.3 FB2.1 R6.2 ; port VGA In.GRN
HSYf: C17.2 D7.3 FB6.2 VGAHead1.13
HSYin: FB6.1 ; port VGA In.HSYNC
Rfiltered: C12.1 FB1.2 VGAHead1.1
Rin: C11.1 D8.3 FB1.1 R8.2 ; port VGA In.RED
VSYf: C18.2 D10.3 FB7.2 VGAHead1.14
VSYin: FB7.1 ; port VGA In.VSYNC

Not connected (* = marked no-connect by the designer): VGAHead1 4 11 16

### Channels
XTX1_VGA: designators C11=XTX1_VGA_C11 C12=XTX1_VGA_C12 C13=XTX1_VGA_C13 C14=XTX1_VGA_C14 C15=XTX1_VGA_C15 C16=XTX1_VGA_C16 C17=XTX1_VGA_C17 C18=XTX1_VGA_C18 D6=XTX1_VGA_D6 D7=XTX1_VGA_D7 D8=XTX1_VGA_D8 D9=XTX1_VGA_D9 D10=XTX1_VGA_D10 FB1=XTX1_VGA_FB1 FB2=XTX1_VGA_FB2 FB3=XTX1_VGA_FB3 FB4=XTX1_VGA_FB4 FB5=XTX1_VGA_FB5 FB6=XTX1_VGA_FB6 FB7=XTX1_VGA_FB7 FB8=XTX1_VGA_FB8 R6=XTX1_VGA_R6 R7=XTX1_VGA_R7 R8=XTX1_VGA_R8 VGAHead1=XTX1_VGA_VGAHead1
XTX2_VGA: designators C11=XTX2_VGA_C11 C12=XTX2_VGA_C12 C13=XTX2_VGA_C13 C14=XTX2_VGA_C14 C15=XTX2_VGA_C15 C16=XTX2_VGA_C16 C17=XTX2_VGA_C17 C18=XTX2_VGA_C18 D6=XTX2_VGA_D6 D7=XTX2_VGA_D7 D8=XTX2_VGA_D8 D9=XTX2_VGA_D9 D10=XTX2_VGA_D10 FB1=XTX2_VGA_FB1 FB2=XTX2_VGA_FB2 FB3=XTX2_VGA_FB3 FB4=XTX2_VGA_FB4 FB5=XTX2_VGA_FB5 FB6=XTX2_VGA_FB6 FB7=XTX2_VGA_FB7 FB8=XTX2_VGA_FB8 R6=XTX2_VGA_R6 R7=XTX2_VGA_R7 R8=XTX2_VGA_R8 VGAHead1=XTX2_VGA_VGAHead1

### Library data of the parts
C11-C18 = Capacitor (non-polarized): Capacitor; Supplier: Digi-Key
  C11-C16: Value: 3.3pF; Supplier Part Number: 478-1298-1-ND
  C17 C18: Value: 10pF; Supplier Part Number: 478-1304-1-ND
D7 D8 = Dual Schottky Diode: Supplier Part Number: 497-2516-1-ND; Supplier: Digi-Key
FB1-FB8 = Ferrite Beads: Supplier Part Number: 490-1041-1-ND; Supplier: Digi-Key
R6 R7 = Resistor: Value: 150Ohm 1%; Supplier Part Number: RHM150CRCT-ND; Supplier: Digi-Key
R8 = Resistor: Value: 150Ohm 1%; Supplier Part Number: RHM150CRCT-ND; Supplier: Digi-Key
VGAHead1 = 8x2: 8x2 100mil Header; Supplier Part Number: 609-3364-ND; Supplier: Digi-Key
D6 D9 D10 = Dual Schottky Diode: Supplier Part Number: 497-2516-1-ND; Supplier: Digi-Key

## Sheet SATA.SchDoc
size A; DocumentNumber: 2; SheetNumber: 2; SheetTotal: 8
Used 2 times, as channels XTX1_SATA, XTX2_SATA. Parts and nets are listed once, with the designators drawn on the sheet.
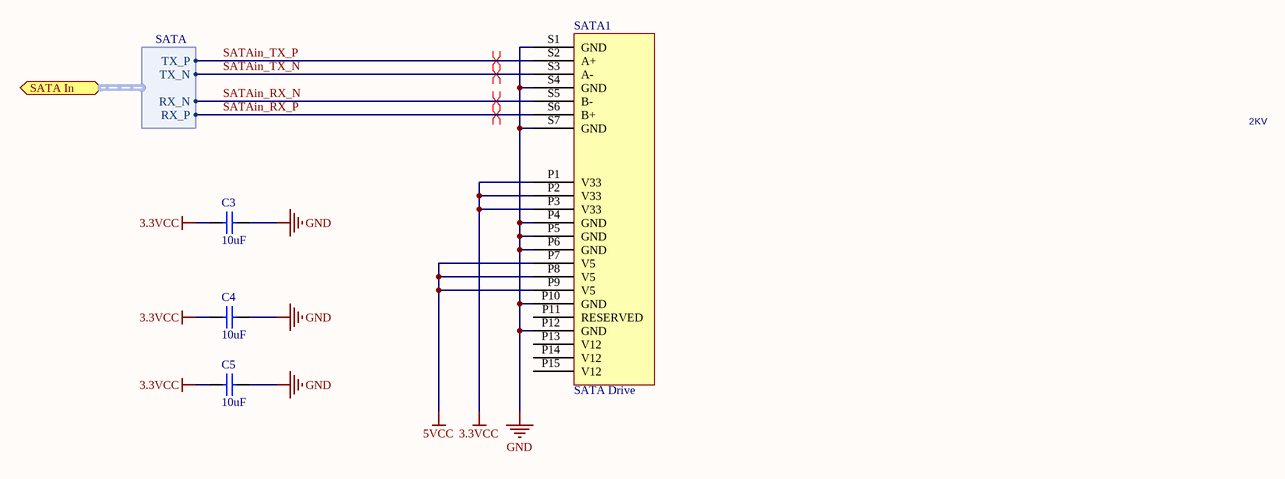
[diagram p4: SATA.SchDoc]

### Parts
C3  10uF  [1210 (3225) Capacitor]
C4  10uF  [1210 (3225) Capacitor]
C5  10uF  [1210 (3225) Capacitor]
SATA1  SATA Drive  [SandiskMini]

### Ports
SATA In (harness SATA)

### Harnesses
SATA: TX_P, TX_N, RX_N, RX_P

### Nets
3.3VCC: C3.2 C4.2 C5.2 SATA1.P1(V33) SATA1.P2(V33) SATA1.P3(V33)
5VCC: SATA1.P7(V5) SATA1.P8(V5) SATA1.P9(V5)
GND: C3.1 C4.1 C5.1 SATA1.P4(GND) SATA1.P5(GND) SATA1.P6(GND) SATA1.P10(GND) SATA1.P12(GND) SATA1.S1(GND) SATA1.S4(GND) SATA1.S7(GND)
SATAin_RX_N: SATA1.S5(B-) ; port SATA In.RX_N
SATAin_RX_P: SATA1.S6(B+) ; port SATA In.RX_P
SATAin_TX_N: SATA1.S3(A-) ; port SATA In.TX_N
SATAin_TX_P: SATA1.S2(A+) ; port SATA In.TX_P

Not connected (* = marked no-connect by the designer): SATA1 P11(RESERVED) P13(V12) P14(V12) P15(V12)

### Channels
XTX1_SATA: designators C3=XTX1_SATA_C3 C4=XTX1_SATA_C4 C5=XTX1_SATA_C5 SATA1=XTX1_SATA_SATA1
XTX2_SATA: designators C3=XTX2_SATA_C3 C4=XTX2_SATA_C4 C5=XTX2_SATA_C5 SATA1=XTX2_SATA_SATA1

### Layout directives
differential pair: SATA0_RX_N, SATA0_RX_P, SATA0_TX_N, SATA0_TX_P

### Notes on the sheet
- 2KV

### Library data of the parts
C3-C5 = Capacitor (non-polarized): Capacitor; Value: 10nF; Digikey Part Number: Digi-Key; Supplier Part Number: 445-1401-1-ND; Supplier: Digi-Key
SATA1 = SATA Drive: SATA HDD, FCI Part# 10029364; Supplier Part Number: 609-1028-ND; Supplier: Digi-Key

## Sheet LEDSandButtons.SchDoc
size A; DocumentNumber: 8; SheetNumber: 8; SheetTotal: 8
Used 2 times, as channels XTX1_Interface, XTX2_Interface. Parts and nets are listed once, with the designators drawn on the sheet.
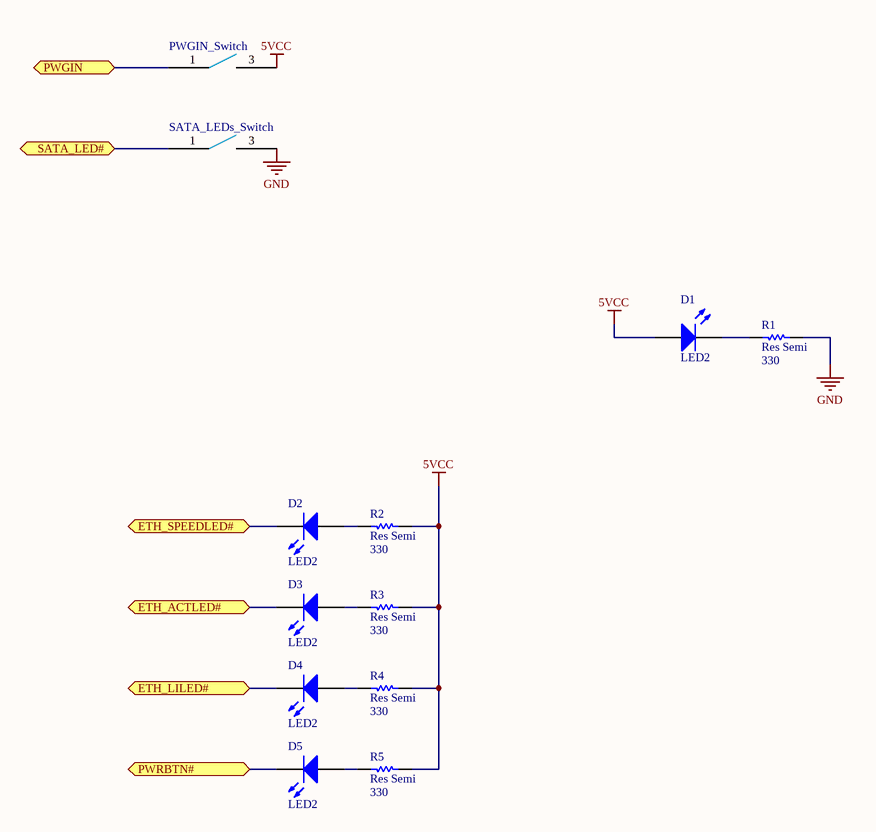
[diagram p5: LEDSandButtons.SchDoc]

### Parts
D1  LED2  [C0805]
D2  LED2  [C0805]
D3  LED2  [C0805]
D4  LED2  [C0805]
D5  LED2  [C0805]
PWGIN_Switch  Switch  [GS02MCBE]  (value not drawn)
R1  Res Semi  value 330  [1005[0402]]
R2  Res Semi  value 330  [1005[0402]]
R3  Res Semi  value 330  [1005[0402]]
R4  Res Semi  value 330  [1005[0402]]
R5  Res Semi  value 330  [1005[0402]]
SATA_LEDs_Switch  Switch  [GS02MCBE]  (value not drawn)

### Ports
ETH_ACTLED#, ETH_LILED#, ETH_SPEEDLED#, PWGIN, PWRBTN#, SATA_LED#

### Nets
5VCC: D1.1(A) PWGIN_Switch.3 R2.1 R3.1 R4.1 R5.1
GND: R1.1 SATA_LEDs_Switch.3
ETH_ACTLED#: D3.2(K) ; port ETH_ACTLED#
ETH_LILED#: D4.2(K) ; port ETH_LILED#
ETH_SPEEDLED#: D2.2(K) ; port ETH_SPEEDLED#
PWGIN: PWGIN_Switch.1 ; port PWGIN
PWRBTN#: D5.2(K) ; port PWRBTN#
SATA_LED#: SATA_LEDs_Switch.1 ; port SATA_LED#
NetD1_2: D1.2(K) R1.2
NetD2_1: D2.1(A) R2.2
NetD3_1: D3.1(A) R3.2
NetD4_1: D4.1(A) R4.2
NetD5_1: D5.1(A) R5.2

### Channels
XTX1_Interface: designators D1=XTX1_Interface_D1 D2=XTX1_Interface_D2 D3=XTX1_Interface_D3 D4=XTX1_Interface_D4 D5=XTX1_Interface_D5 PWGIN_Switch=XTX1_Interface_PWGIN_Switch R1=XTX1_Interface_R1 R2=XTX1_Interface_R2 R3=XTX1_Interface_R3 R4=XTX1_Interface_R4 R5=XTX1_Interface_R5 SATA_LEDs_Switch=XTX1_Interface_SATA_LEDs_Switch; ports ETH_ACTLED#=ETH_ACTLED# ETH_LILED#=ETH_LILED# ETH_SPEEDLED#=ETH_SPEEDLED# PWGIN=NetXTX1_Interface_PWGIN_Switch_1 PWRBTN#=NetXTX1_Interface_D5_2 SATA_LED#=SATALED#
XTX2_Interface: designators D1=XTX2_Interface_D1 D2=XTX2_Interface_D2 D3=XTX2_Interface_D3 D4=XTX2_Interface_D4 D5=XTX2_Interface_D5 PWGIN_Switch=XTX2_Interface_PWGIN_Switch R1=XTX2_Interface_R1 R2=XTX2_Interface_R2 R3=XTX2_Interface_R3 R4=XTX2_Interface_R4 R5=XTX2_Interface_R5 SATA_LEDs_Switch=XTX2_Interface_SATA_LEDs_Switch; ports ETH_ACTLED#=ETH_ACTLED# ETH_LILED#=ETH_LILED# ETH_SPEEDLED#=ETH_SPEEDLED# PWGIN=NetXTX2_Interface_PWGIN_Switch_1 PWRBTN#=NetXTX2_Interface_D5_2 SATA_LED#=SATALED#

### Library data of the parts
D1-D5 = LED2: Typical RED, GREEN, YELLOW, AMBER GaAs LED; Published: 8-Jun-2000; LatestRevisionDate: 17-Jul-2002; LatestRevisionNote: Re-released for DXP Platform.; PackageDocument: Feb-2002; PackageReference: 3.2X1.6X1.1; Publisher: Altium Limited; Supplier Part Number: 160-1423-1-ND; Supplier: Digi-Key
R1-R5 = Res Semi: Semiconductor Resistor; Published: 8-Jun-2000; LatestRevisionDate: 17-Jul-2002; LatestRevisionNote: Re-released for DXP Platform.; PackageReference: AXIAL-0.5; Publisher: Altium Limited; Supplier Part Number: P330JCT-ND; Supplier: Digi-Key
PWGIN_Switch SATA_LEDs_Switch = Switch: Supplier Part Number: GS02MCBE; Supplier: Digi-Key

## Sheet EthernetMagJack.SchDoc
size A
Used 2 times, as channels XTX1_EthernetJack, XTX2_EthernetJack. Parts and nets are listed once, with the designators drawn on the sheet.
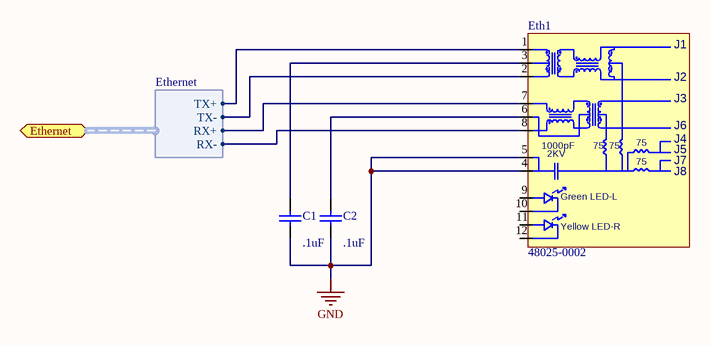
[diagram p6: EthernetMagJack.SchDoc]

### Parts
C1  value .1uF  [0402]  (hidden comment: Cap Semi)
C2  value .1uF  [0402]  (hidden comment: Cap Semi)
Eth1  48025-0002  [48025-0002]

### Ports
Ethernet (harness Ethernet)

### Harnesses
Ethernet: RX-, RX+, TX-, TX+

### Nets
GND: C1.1 C2.1 Eth1.4 Eth1.5
NetC1_2: C1.2 Eth1.3
NetC2_2: C2.2 Eth1.6
NetEth1_1: Eth1.1 ; port Ethernet.TX+
NetEth1_2: Eth1.2 ; port Ethernet.TX-
NetEth1_7: Eth1.7 ; port Ethernet.RX+
NetEth1_8: Eth1.8 ; port Ethernet.RX-

Not connected (* = marked no-connect by the designer): Eth1 9 10 11 12

### Channels
XTX1_EthernetJack: designators C1=XTX1_EthernetJack_C1 C2=XTX1_EthernetJack_C2 Eth1=XTX1_EthernetJack_Eth1
XTX2_EthernetJack: designators C1=XTX2_EthernetJack_C1 C2=XTX2_EthernetJack_C2 Eth1=XTX2_EthernetJack_Eth1

### Notes on the sheet
- (in symbol 48025-0002) J1; J2; J3; J6; J4; 1000pF; 75; 2KV; J5; J7; J8; Green LED-L; Yellow LED-R

### Library data of the parts
C1 C2 = Cap Semi: Capacitor (Semiconductor SIM Model); Published: 8-Jun-2000; LatestRevisionDate: 17-Jul-2002; LatestRevisionNote: Re-released for DXP Platform.; PackageReference: C1206; Publisher: Altium Limited; Supplier Part Number: 490-1318-1-ND; Supplier: Digi-Key
Eth1 = 48025-0002: Modular RJ45 Jack w/ Magnetics & LEDs; Supplier: Digi-Key; Supplier Part Number: WM5483-ND

## Sheet SerialLvlConvert.SchDoc
size A; DocumentNumber: 7; SheetNumber: 7; SheetTotal: 8
Used 2 times, as channels XTX1_RS232, XTX1_RS232. Parts and nets are listed once, with the designators drawn on the sheet.
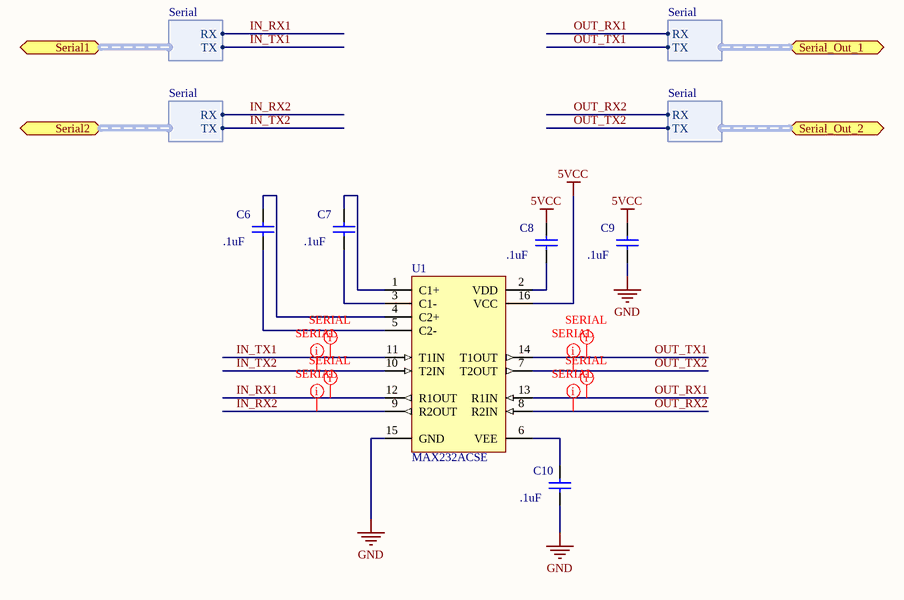
[diagram p7: SerialLvlConvert.SchDoc]

### Parts
C6  value .1uF  [0402]  (hidden comment: Cap Semi)
C7  value .1uF  [0402]  (hidden comment: Cap Semi)
C8  value .1uF  [0402]  (hidden comment: Cap Semi)
C9  value .1uF  [0402]  (hidden comment: Cap Semi)
C10  value .1uF  [0402]  (hidden comment: Cap Semi)
U1  MAX232ACSE  [NSO16_N]

### Ports
Serial1 (harness Serial), Serial2 (harness Serial), Serial_Out_1 (harness Serial), Serial_Out_2 (harness Serial)

### Harnesses
Serial: RX, TX

### Nets
5VCC: C8.1 C9.1 U1.16(VCC)
GND: C9.2 C10.2 U1.15(GND)
IN_RX1: U1.12(R1OUT) ; port Serial1.RX
IN_RX2: U1.9(R2OUT) ; port Serial2.RX
IN_TX1: U1.11(T1IN) ; port Serial1.TX
IN_TX2: U1.10(T2IN) ; port Serial2.TX
OUT_RX1: U1.13(R1IN) ; port Serial_Out_1.RX
OUT_RX2: U1.8(R2IN) ; port Serial_Out_2.RX
OUT_TX1: U1.14(T1OUT) ; port Serial_Out_1.TX
OUT_TX2: U1.7(T2OUT) ; port Serial_Out_2.TX
NetC6_1: C6.1 U1.4(C2+)
NetC6_2: C6.2 U1.5(C2-)
NetC7_1: C7.1 U1.1(C1+)
NetC7_2: C7.2 U1.3(C1-)
NetC8_2: C8.2 U1.2(VDD)
NetC10_1: C10.1 U1.6(VEE)

### Channels
XTX1_RS232: designators C6=XTX1_RS232_C6#1 C7=XTX1_RS232_C7#1 C8=XTX1_RS232_C8#1 C9=XTX1_RS232_C9#1 C10=XTX1_RS232_C10#1 U1=XTX1_RS232_U1#1
XTX1_RS232: designators C6=XTX1_RS232_C6#2 C7=XTX1_RS232_C7#2 C8=XTX1_RS232_C8#2 C9=XTX1_RS232_C9#2 C10=XTX1_RS232_C10#2 U1=XTX1_RS232_U1#2

### Layout directives
rule Width Constraint [Pref Width = 5mil    Min Width = 5mil    Max Width = 5mil]; rule Length Constraint [Min Length = 0mil    Max Length = 6500mil]; rule Differential Pairs Routing [Pref Gap = 4mil    Min Gap  = 4mil    Max Gap  = 4mil]; rule Matched Net Lengths [Tolerance = 3000mil]; net class USB: IN_RX1, IN_RX2, IN_TX1, IN_TX2, OUT_RX1, OUT_RX2, OUT_TX1, OUT_TX2

### Library data of the parts
C6-C10 = Cap Semi: Capacitor (Semiconductor SIM Model); Published: 8-Jun-2000; LatestRevisionDate: 17-Jul-2002; LatestRevisionNote: Re-released for DXP Platform.; PackageReference: C1206; Publisher: Altium Limited; Supplier Part Number: 490-1318-1-ND; Supplier: Digi-Key
U1 = MAX232ACSE: +5V Powered, Multi-Channel RS-232 Driver/Receiver; Published: 16-Jan-2001; LatestRevisionDate: 13-Apr-2006; LatestRevisionNote: IPC-7351 Footprint Added.; PackageReference: NSO16; Publisher: Altium Limited; PackageDescription: 16-Pin Small Outline Integrated Circuit 1.27 mm Pitch; Code_JEDEC: MS-012-AC; Code_IPC: SOIC127P600-16; ComponentLink1Description: Manufacturer Link; ComponentLink1URL: http://www.maxim-ic.com/; ComponentLink2Description: Datasheet; ComponentLink2URL: http://pdfserv.maxim-ic.com/en/ds/MAX220-MAX249.pdf; Supplier Part Number: 52K5506; Supplier: Newark

## Nets that join several sheets
3.3VCC: XTXBoard(2CPU) (6 pins), XTX1 (XTX1_XTX1.12 XTX1_XTX1.16 XTX1_XTX1.24), XTX1_VGA (6 pins), XTX1_SATA (6 pins), XTX2 (XTX2_XTX1.12 XTX2_XTX1.16 XTX2_XTX1.24), XTX2_VGA (6 pins), XTX2_SATA (6 pins)
5VCC: XTXBoard(2CPU) (29 pins), XTX1 (28 pins), XTX1_SATA (XTX1_SATA_SATA1.P7 XTX1_SATA_SATA1.P8 XTX1_SATA_SATA1.P9), XTX1_Interface (6 pins), XTX2 (28 pins), XTX2_Interface (6 pins), XTX2_SATA (XTX2_SATA_SATA1.P7 XTX2_SATA_SATA1.P8 XTX2_SATA_SATA1.P9), XTX1_RS232 (XTX1_RS232_C8#1.1 XTX1_RS232_C9#1.1 XTX1_RS232_U1#1.16), XTX1_RS232 (XTX1_RS232_C8#2.1 XTX1_RS232_C9#2.1 XTX1_RS232_U1#2.16)
GND: XTXBoard(2CPU) (45 pins), XTX1 (51 pins), XTX1_VGA (21 pins), XTX1_SATA (11 pins), XTX1_Interface (XTX1_Interface_R1.1 XTX1_Interface_SATA_LEDs_Switch.3), XTX1_EthernetJack (XTX1_EthernetJack_C1.1 XTX1_EthernetJack_C2.1 XTX1_EthernetJack_Eth1.4 XTX1_EthernetJack_Eth1.5), XTX2 (51 pins), XTX2_Interface (XTX2_Interface_R1.1 XTX2_Interface_SATA_LEDs_Switch.3), XTX2_VGA (21 pins), XTX2_SATA (11 pins), XTX2_EthernetJack (XTX2_EthernetJack_C1.1 XTX2_EthernetJack_C2.1 XTX2_EthernetJack_Eth1.4 XTX2_EthernetJack_Eth1.5), XTX1_RS232 (XTX1_RS232_C9#1.2 XTX1_RS232_C10#1.2 XTX1_RS232_U1#1.15), XTX1_RS232 (XTX1_RS232_C9#2.2 XTX1_RS232_C10#2.2 XTX1_RS232_U1#2.15)
B: XTX1 (XTX1_XTX1.204), XTX1_VGA (XTX1_VGA_C15.1 XTX1_VGA_D9.3 XTX1_VGA_FB3.1 XTX1_VGA_R7.2)
B: XTX2 (XTX2_XTX1.204), XTX2_VGA (XTX2_VGA_C15.1 XTX2_VGA_D9.3 XTX2_VGA_FB3.1 XTX2_VGA_R7.2)
DDCK: XTX1 (XTX1_XTX1.208), XTX1_VGA (XTX1_VGA_FB8.1)
DDCK: XTX2 (XTX2_XTX1.208), XTX2_VGA (XTX2_VGA_FB8.1)
DDDA: XTX1 (XTX1_XTX1.210), XTX1_VGA (XTX1_VGA_FB5.1)
DDDA: XTX2 (XTX2_XTX1.210), XTX2_VGA (XTX2_VGA_FB5.1)
ETH_ACTLED#: XTX1 (XTX1_XTX1.312), XTX1_Interface (XTX1_Interface_D3.2)
ETH_ACTLED#: XTX2 (XTX2_XTX1.312), XTX2_Interface (XTX2_Interface_D3.2)
ETH_LILED#: XTX1 (XTX1_XTX1.310), XTX1_Interface (XTX1_Interface_D4.2)
ETH_LILED#: XTX2 (XTX2_XTX1.310), XTX2_Interface (XTX2_Interface_D4.2)
ETH_RXD_N: XTX1 (XTX1_XTX1.391), XTX1_EthernetJack (XTX1_EthernetJack_Eth1.8)
ETH_RXD_N: XTX2 (XTX2_XTX1.391), XTX2_EthernetJack (XTX2_EthernetJack_Eth1.8)
ETH_RXD_P: XTX1 (XTX1_XTX1.393), XTX1_EthernetJack (XTX1_EthernetJack_Eth1.7)
ETH_RXD_P: XTX2 (XTX2_XTX1.393), XTX2_EthernetJack (XTX2_EthernetJack_Eth1.7)
ETH_SPEEDLED#: XTX1 (XTX1_XTX1.314), XTX1_Interface (XTX1_Interface_D2.2)
ETH_SPEEDLED#: XTX2 (XTX2_XTX1.314), XTX2_Interface (XTX2_Interface_D2.2)
ETH_TXD_N: XTX1 (XTX1_XTX1.395), XTX1_EthernetJack (XTX1_EthernetJack_Eth1.2)
ETH_TXD_N: XTX2 (XTX2_XTX1.395), XTX2_EthernetJack (XTX2_EthernetJack_Eth1.2)
ETH_TXD_P: XTX1 (XTX1_XTX1.397), XTX1_EthernetJack (XTX1_EthernetJack_Eth1.1)
ETH_TXD_P: XTX2 (XTX2_XTX1.397), XTX2_EthernetJack (XTX2_EthernetJack_Eth1.1)
G: XTX1 (XTX1_XTX1.206), XTX1_VGA (XTX1_VGA_C13.1 XTX1_VGA_D6.3 XTX1_VGA_FB2.1 XTX1_VGA_R6.2)
G: XTX2 (XTX2_XTX1.206), XTX2_VGA (XTX2_VGA_C13.1 XTX2_VGA_D6.3 XTX2_VGA_FB2.1 XTX2_VGA_R6.2)
HSY: XTX1 (XTX1_XTX1.205), XTX1_VGA (XTX1_VGA_FB6.1)
HSY: XTX2 (XTX2_XTX1.205), XTX2_VGA (XTX2_VGA_FB6.1)
IL_SATA#: XTXBoard(2CPU) (J13.2), XTX1 (XTX1_XTX1.158)
IL_SATA#: XTXBoard(2CPU) (J14.2), XTX2 (XTX2_XTX1.158)
IN_RX1: XTXBoard(2CPU) (XTX1_RXTX_1.1), XTX1 (XTX1_XTX1.283), XTX1_RS232 (XTX1_RS232_U1#1.12)
IN_RX1: XTXBoard(2CPU) (XTX2_RXTX_1.1), XTX2 (XTX2_XTX1.283), XTX1_RS232 (XTX1_RS232_U1#2.12)
IN_RX2: XTXBoard(2CPU) (XTX1_RXTX_2.1), XTX1 (XTX1_XTX1.263), XTX1_RS232 (XTX1_RS232_U1#1.9)
IN_RX2: XTXBoard(2CPU) (XTX2_RXTX_2.1), XTX2 (XTX2_XTX1.263), XTX1_RS232 (XTX1_RS232_U1#2.9)
IN_TX1: XTXBoard(2CPU) (XTX1_RXTX_1.2), XTX1 (XTX1_XTX1.295), XTX1_RS232 (XTX1_RS232_U1#1.11)
IN_TX1: XTXBoard(2CPU) (XTX2_RXTX_1.2), XTX2 (XTX2_XTX1.295), XTX1_RS232 (XTX1_RS232_U1#2.11)
IN_TX2: XTXBoard(2CPU) (XTX1_RXTX_2.2), XTX1 (XTX1_XTX1.277), XTX1_RS232 (XTX1_RS232_U1#1.10)
IN_TX2: XTXBoard(2CPU) (XTX2_RXTX_2.2), XTX2 (XTX2_XTX1.277), XTX1_RS232 (XTX1_RS232_U1#2.10)
NetXTX1_Interface_D5_2: XTX1 (XTX1_XTX1.307), XTX1_Interface (XTX1_Interface_D5.2)
NetXTX1_Interface_PWGIN_Switch_1: XTX1 (XTX1_XTX1.304), XTX1_Interface (XTX1_Interface_PWGIN_Switch.1)
NetXTX2_Interface_D5_2: XTX2 (XTX2_XTX1.307), XTX2_Interface (XTX2_Interface_D5.2)
NetXTX2_Interface_PWGIN_Switch_1: XTX2 (XTX2_XTX1.304), XTX2_Interface (XTX2_Interface_PWGIN_Switch.1)
OUT_RX1: XTXBoard(2CPU) (XTX1_232_1.1), XTX1_RS232 (XTX1_RS232_U1#1.13)
OUT_RX1: XTXBoard(2CPU) (XTX2_232_1.1), XTX1_RS232 (XTX1_RS232_U1#2.13)
OUT_RX2: XTXBoard(2CPU) (XTX1_232_2.1), XTX1_RS232 (XTX1_RS232_U1#1.8)
OUT_RX2: XTXBoard(2CPU) (XTX2_232_2.1), XTX1_RS232 (XTX1_RS232_U1#2.8)
OUT_TX1: XTXBoard(2CPU) (XTX1_232_1.2), XTX1_RS232 (XTX1_RS232_U1#1.14)
OUT_TX1: XTXBoard(2CPU) (XTX2_232_1.2), XTX1_RS232 (XTX1_RS232_U1#2.14)
OUT_TX2: XTXBoard(2CPU) (XTX1_232_2.2), XTX1_RS232 (XTX1_RS232_U1#1.7)
OUT_TX2: XTXBoard(2CPU) (XTX2_232_2.2), XTX1_RS232 (XTX1_RS232_U1#2.7)
R: XTX1 (XTX1_XTX1.203), XTX1_VGA (XTX1_VGA_C11.1 XTX1_VGA_D8.3 XTX1_VGA_FB1.1 XTX1_VGA_R8.2)
R: XTX2 (XTX2_XTX1.203), XTX2_VGA (XTX2_VGA_C11.1 XTX2_VGA_D8.3 XTX2_VGA_FB1.1 XTX2_VGA_R8.2)
SATA0_RX_N: XTX1 (XTX1_XTX1.106), XTX1_SATA (XTX1_SATA_SATA1.S5)
SATA0_RX_N: XTX2 (XTX2_XTX1.106), XTX2_SATA (XTX2_SATA_SATA1.S5)
SATA0_RX_P: XTX1 (XTX1_XTX1.104), XTX1_SATA (XTX1_SATA_SATA1.S6)
SATA0_RX_P: XTX2 (XTX2_XTX1.104), XTX2_SATA (XTX2_SATA_SATA1.S6)
SATA0_TX_N: XTX1 (XTX1_XTX1.110), XTX1_SATA (XTX1_SATA_SATA1.S3)
SATA0_TX_N: XTX2 (XTX2_XTX1.110), XTX2_SATA (XTX2_SATA_SATA1.S3)
SATA0_TX_P: XTX1 (XTX1_XTX1.112), XTX1_SATA (XTX1_SATA_SATA1.S2)
SATA0_TX_P: XTX2 (XTX2_XTX1.112), XTX2_SATA (XTX2_SATA_SATA1.S2)
SATALED#: XTX1 (XTX1_XTX1.150), XTX1_Interface (XTX1_Interface_SATA_LEDs_Switch.1)
SATALED#: XTX2 (XTX2_XTX1.150), XTX2_Interface (XTX2_Interface_SATA_LEDs_Switch.1)
USB0_N: XTXBoard(2CPU) (J5.2), XTX1 (XTX1_XTX1.76)
USB0_N: XTXBoard(2CPU) (J6.2), XTX2 (XTX2_XTX1.76)
USB0_P: XTXBoard(2CPU) (J5.3), XTX1 (XTX1_XTX1.88)
USB0_P: XTXBoard(2CPU) (J6.3), XTX2 (XTX2_XTX1.88)
USB1_N: XTXBoard(2CPU) (J7.2), XTX1 (XTX1_XTX1.80)
USB1_N: XTXBoard(2CPU) (J8.2), XTX2 (XTX2_XTX1.80)
USB1_P: XTXBoard(2CPU) (J7.3), XTX1 (XTX1_XTX1.92)
USB1_P: XTXBoard(2CPU) (J8.3), XTX2 (XTX2_XTX1.92)
USB2_N: XTXBoard(2CPU) (J9.2), XTX1 (XTX1_XTX1.58)
USB2_N: XTXBoard(2CPU) (J10.2), XTX2 (XTX2_XTX1.58)
USB2_P: XTXBoard(2CPU) (J9.3), XTX1 (XTX1_XTX1.66)
USB2_P: XTXBoard(2CPU) (J10.3), XTX2 (XTX2_XTX1.66)
USB3_N: XTXBoard(2CPU) (J11.2), XTX1 (XTX1_XTX1.62)
USB3_N: XTXBoard(2CPU) (J12.2), XTX2 (XTX2_XTX1.62)
USB3_P: XTXBoard(2CPU) (J11.3), XTX1 (XTX1_XTX1.72)
USB3_P: XTXBoard(2CPU) (J12.3), XTX2 (XTX2_XTX1.72)
USB4_N: XTXBoard(2CPU) (J3.2), XTX1 (XTX1_XTX1.147)
USB4_N: XTXBoard(2CPU) (J4.2), XTX2 (XTX2_XTX1.147)
USB4_P: XTXBoard(2CPU) (J3.3), XTX1 (XTX1_XTX1.145)
USB4_P: XTXBoard(2CPU) (J4.3), XTX2 (XTX2_XTX1.145)
USB5_N: XTXBoard(2CPU) (J1.2), XTX1 (XTX1_XTX1.127)
USB5_N: XTXBoard(2CPU) (J2.2), XTX2 (XTX2_XTX1.127)
USB5_P: XTXBoard(2CPU) (J1.3), XTX1 (XTX1_XTX1.125)
USB5_P: XTXBoard(2CPU) (J2.3), XTX2 (XTX2_XTX1.125)
VSY: XTX1 (XTX1_XTX1.207), XTX1_VGA (XTX1_VGA_FB7.1)
VSY: XTX2 (XTX2_XTX1.207), XTX2_VGA (XTX2_VGA_FB7.1)